# Altium project Mainboard.PrjPcb (part 1 of 3)
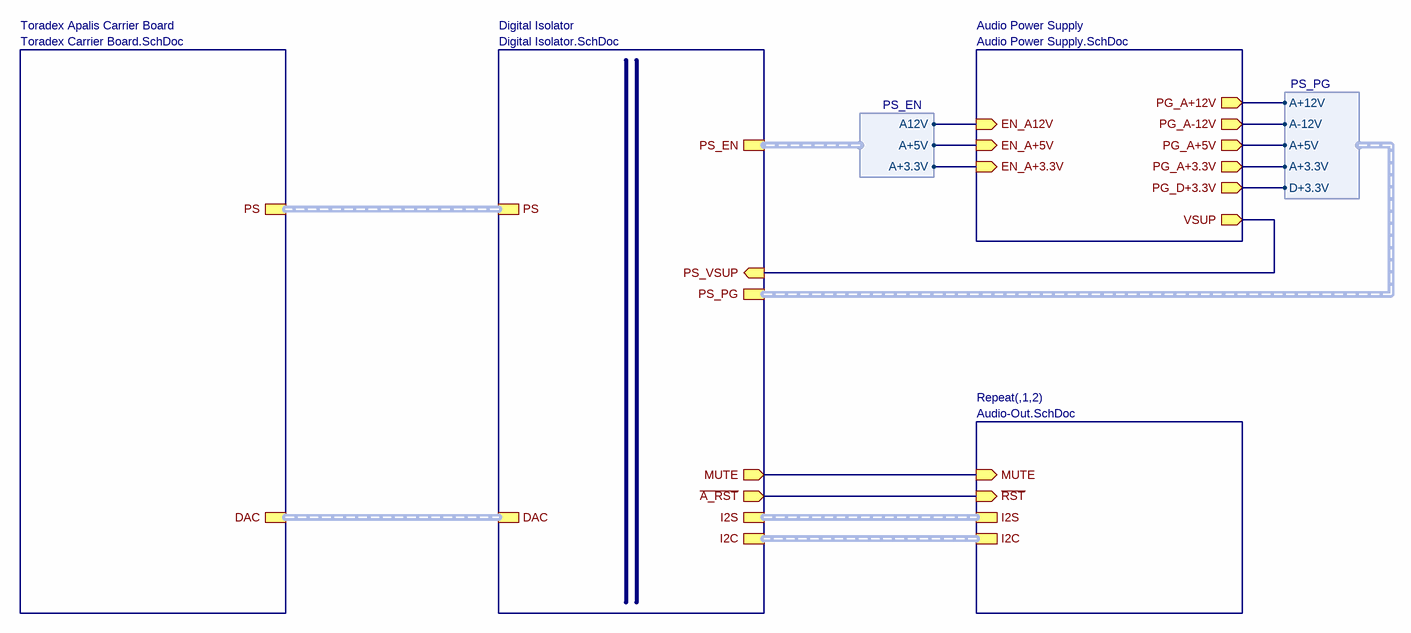
[diagram p0: Hardware Achitecture.SchDoc]
ProjectAuthors: Klossner, Lüthi; ProjectName: Mainboard; Revision: 1.0
19 sheets, 660 parts. Net scope: hierarchical (ports join the sheet entries above them; power ports are global).
Board file: Audio-Streamer-Mainboard.PcbDoc
Sheets:
  Hardware Achitecture.SchDoc
    1 = Audio-Out.SchDoc
    2 = Audio-Out.SchDoc
    Audio Power Supply = Audio Power Supply.SchDoc
    Digital Isolator = Digital Isolator.SchDoc
    Toradex Apalis Carrier Board = Toradex Carrier Board.SchDoc
      Ethernet = Ethernet.SchDoc
      PCI_Express = PCI_Express.SchDoc
      Power_Supply = Power_Supply.SchDoc
      Power_Switch = Power_Switch.SchDoc
      RGB_Display = RGB_Display.SchDoc
      RTC = RTC.SchDoc
      Sata = Sata.SchDoc
      Serial = Serial.SchDoc
      Extension = Extension.SchDoc
      USB_Connectors = USB_Connectors.SchDoc
      USB = USB.SchDoc
      HDMI = HDMI.SchDoc
      Miscellaneous = Miscellaneous.SchDoc
      Audio = Audio.SchDoc

## Sheet Hardware Achitecture.SchDoc
size A3; Date: 27.05.2014; DrawnBy: luths8; Organization: BFH; Address1: Bern University of Applied Sciences; Address2: Engineering and Information Technology; Address3: Jlcoweg 1; Address4: CH-3400 Burgdorf; DocumentNumber: 1; Revision: 1.0; SheetNumber: 1; SheetTotal: 19; CurrentDate: 27.05.2014

### Sub-sheets
Audio Power Supply = Audio Power Supply.SchDoc: PG_A-12V (out), EN_A12V (in), PG_A+3.3V (out), PG_D+3.3V (out), EN_A+3.3V (in), PG_A+12V (out), VSUP (out), EN_A+5V (in), PG_A+5V (out)
Digital Isolator = Digital Isolator.SchDoc: I2C (harness I2C), I2S (harness I2S), DAC (harness DAC), PS (harness PS), ~{A_RST} (out), MUTE (out), PS_VSUP (in), PS_PG (harness PS_PG), PS_EN (harness PS_EN)
Repeat(,1,2) = Audio-Out.SchDoc: ~{RST} (in), I2S (harness I2S), I2C (harness I2C), MUTE (in)
Toradex Apalis Carrier Board = Toradex Carrier Board.SchDoc: PS (harness PS), DAC (harness DAC)

### Harnesses
PS_EN: A12V, A+3.3V, A+5V
PS_PG: A+12V, A-12V, A+3.3V, D+3.3V, A+5V

### Nets
~{A_RST}: sheet Repeat(,1,2)/~{RST}, sheet Digital Isolator/~{A_RST}
MUTE: sheet Repeat(,1,2)/MUTE, sheet Digital Isolator/MUTE
PS_A12V_EN: sheet Audio Power Supply/EN_A12V, sheet Digital Isolator/PS_EN.A12V
PS_A+3.3V_EN: sheet Audio Power Supply/EN_A+3.3V, sheet Digital Isolator/PS_EN.A+3.3V
PS_A+3.3V_PG: sheet Audio Power Supply/PG_A+3.3V, sheet Digital Isolator/PS_PG.A+3.3V
PS_A+5V_EN: sheet Audio Power Supply/EN_A+5V, sheet Digital Isolator/PS_EN.A+5V
PS_A+5V_PG: sheet Audio Power Supply/PG_A+5V, sheet Digital Isolator/PS_PG.A+5V
PS_A+12V_PG: sheet Audio Power Supply/PG_A+12V, sheet Digital Isolator/PS_PG.A+12V
PS_A-12V_PG: sheet Audio Power Supply/PG_A-12V, sheet Digital Isolator/PS_PG.A-12V
PS_D+3.3V_PG: sheet Audio Power Supply/PG_D+3.3V, sheet Digital Isolator/PS_PG.D+3.3V
NetQ400_5: sheet Audio Power Supply/VSUP, sheet Digital Isolator/PS_VSUP

### Buses and harness runs
harness sheet Digital Isolator/DAC = sheet Toradex Apalis Carrier Board/DAC
harness sheet Digital Isolator/I2C = sheet Repeat(,1,2)/I2C
harness sheet Digital Isolator/I2S = sheet Repeat(,1,2)/I2S
harness sheet Digital Isolator/PS = sheet Toradex Apalis Carrier Board/PS

### Notes on the sheet
- Project:
- Size:
- Sheet:
- Title:
- A3
- of
- Drawn by:
- Revision:
- Date:
- Variant:
- b
- File:

## Sheet Audio-Out.SchDoc
size A3; Date: 27.05.2014; DrawnBy: luths8; Organization: BFH; Address1: Bern University of Applied Sciences; Address2: Engineering and Information Technology; Address3: Jlcoweg 1; Address4: CH-3400 Burgdorf; DocumentNumber: 10; Revision: 1.0; SheetNumber: 3; SheetTotal: 19; CurrentDate: 27.05.2014
Used 2 times, as channels 1, 2. Parts and nets are listed once, with the designators drawn on the sheet.
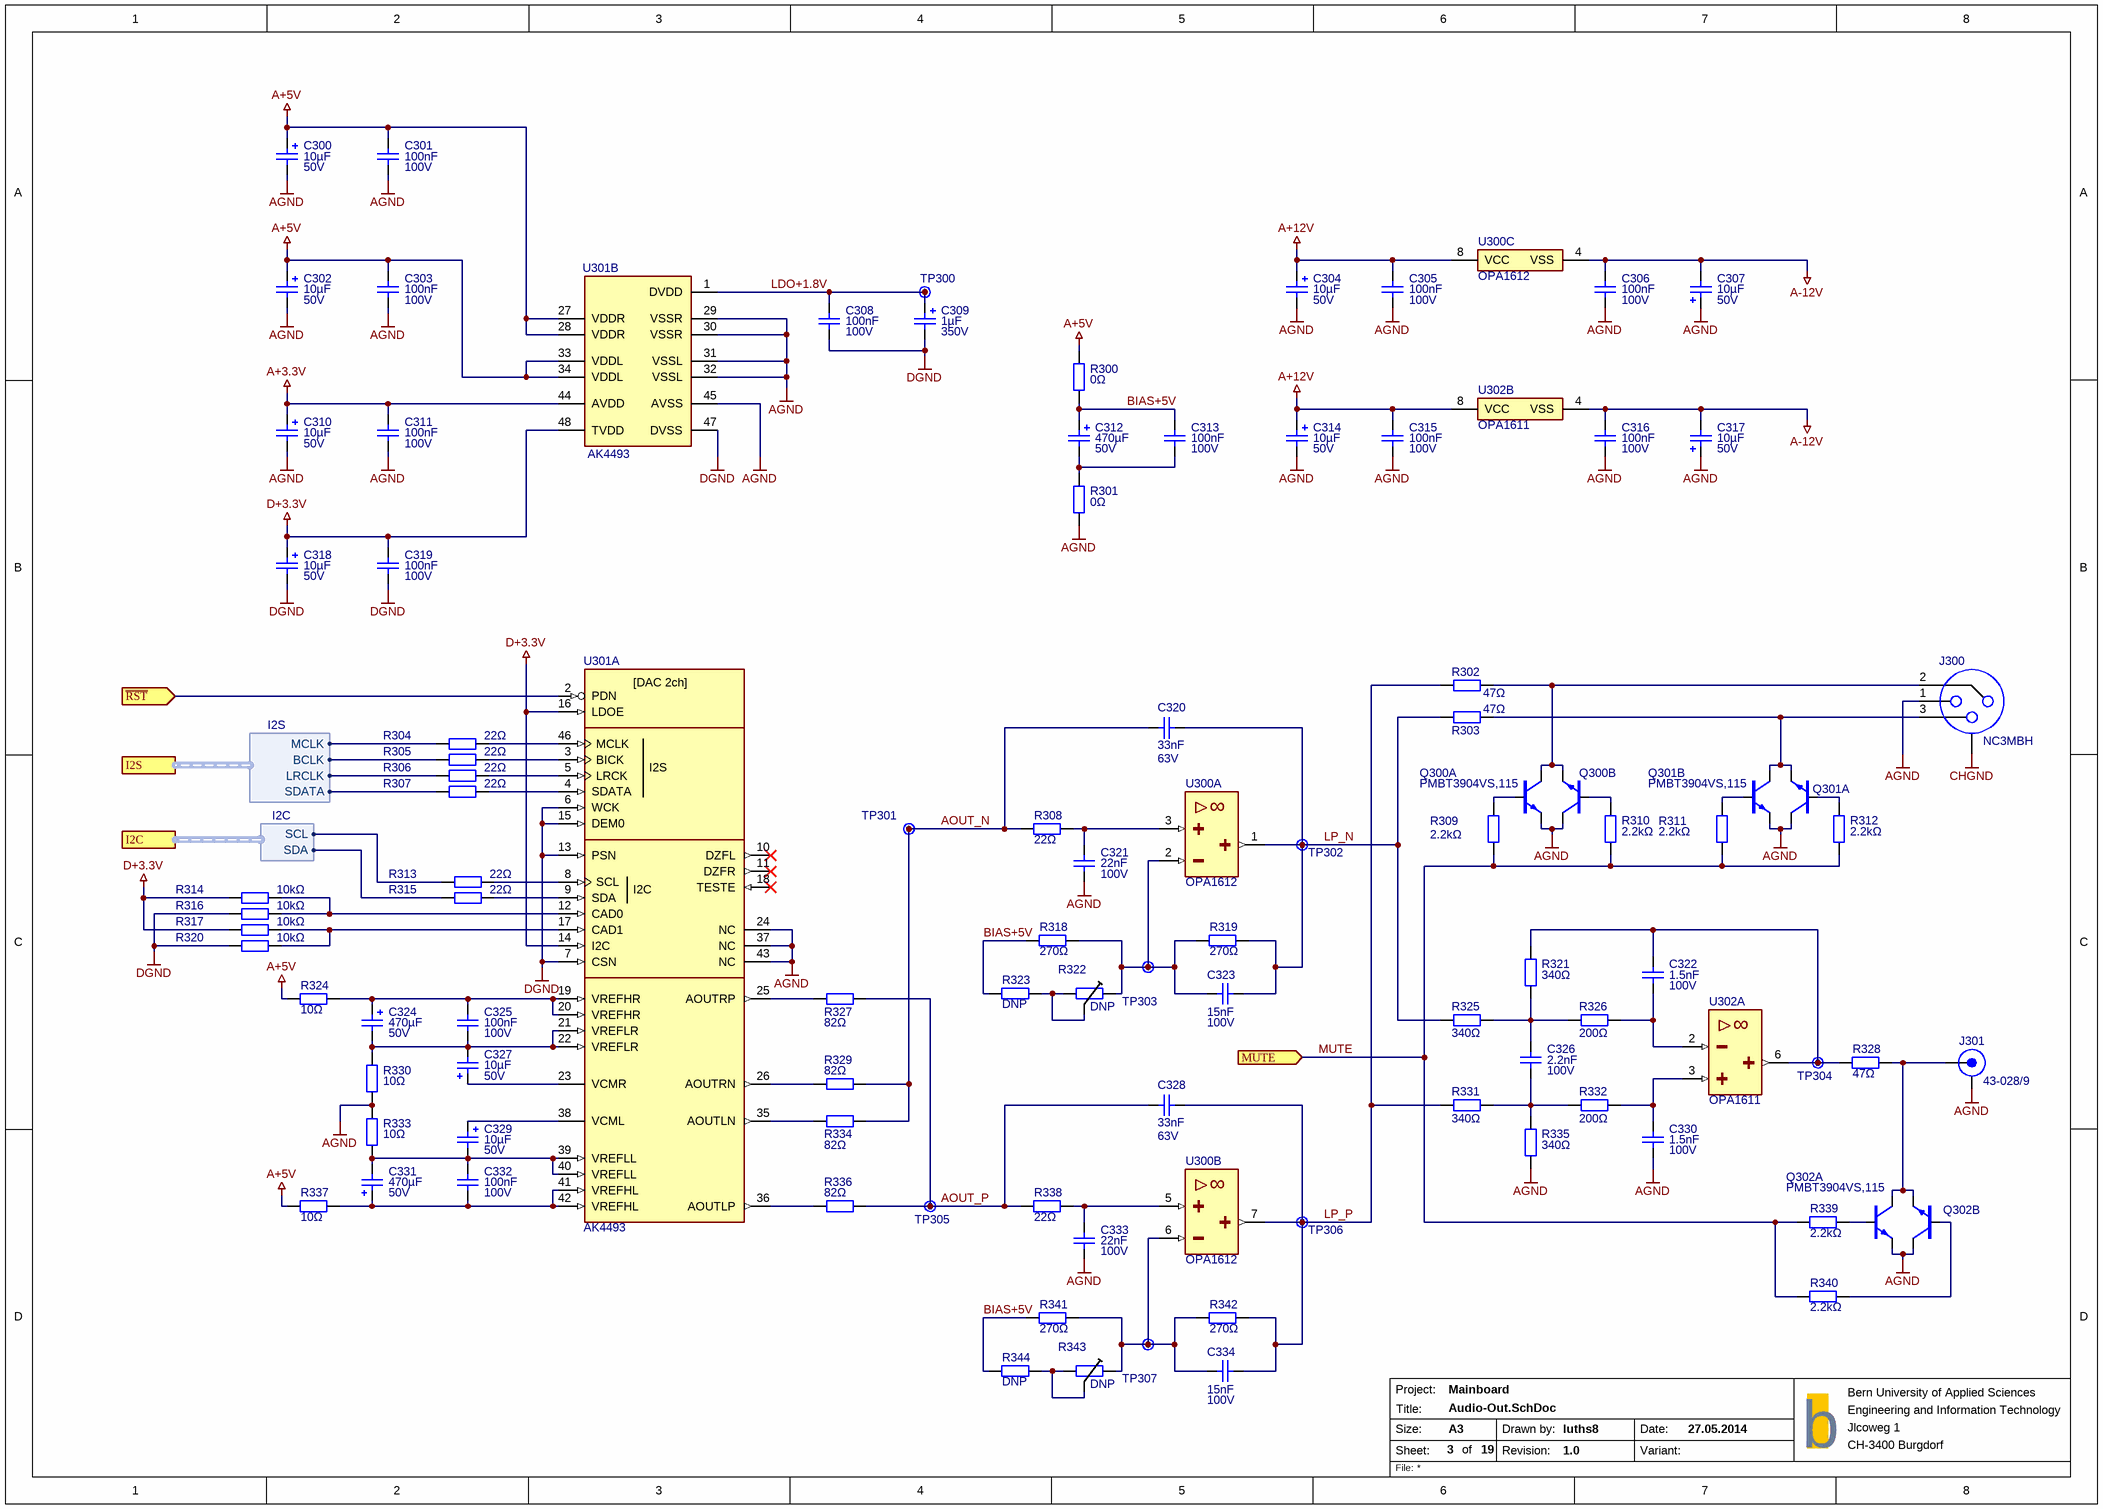
[diagram p1: Audio-Out.SchDoc]

### Parts
C300  10µF  Voltage: 50V  [CAP-5-11.5-2]
C301  100nF  Voltage: 100V  [CAP_WIMA_MKP4F]
C302  10µF  Voltage: 50V  [CAP-5-11.5-2]
C303  100nF  Voltage: 100V  [CAP_WIMA_MKP4F]
C304  10µF  Voltage: 50V  [CAP-5-11.5-2]
C305  100nF  Voltage: 100V  [CAP_WIMA_MKP4F]
C306  100nF  Voltage: 100V  [CAP_WIMA_MKP4F]
C307  10µF  Voltage: 50V  [CAP-5-11.5-2]
C308  100nF  Voltage: 100V  [CAP_WIMA_MKP4F]
C309  1µF  Voltage: 350V  [CAP-6.3-11.2-2.5]
C310  10µF  Voltage: 50V  [CAP-5-11.5-2]
C311  100nF  Voltage: 100V  [CAP_WIMA_MKP4F]
C312  470µF  Voltage: 50V  [CAP-12.5-20-5]
C313  100nF  Voltage: 100V  [CAP_WIMA_MKP4F]
C314  10µF  Voltage: 50V  [CAP-5-11.5-2]
C315  100nF  Voltage: 100V  [CAP_WIMA_MKP4F]
C316  100nF  Voltage: 100V  [CAP_WIMA_MKP4F]
C317  10µF  Voltage: 50V  [CAP-5-11.5-2]
C318  10µF  Voltage: 50V  [CAP-5-11.5-2]
C319  100nF  Voltage: 100V  [CAP_WIMA_MKP4F]
C320  33nF  Voltage: 63V  [CAP_WIMA_FKP2C]
C321  22nF  Voltage: 100V  [CAP_WIMA_FKP2C]
C322  1.5nF  Voltage: 100V  [CAP_WIMA_FKP2D]
C323  15nF  Voltage: 100V  [CAP_WIMA_FKP2C]
C324  470µF  Voltage: 50V  [CAP-12.5-20-5]
C325  100nF  Voltage: 100V  [CAP_WIMA_MKP4F]
C326  2.2nF  Voltage: 100V  [CAP_WIMA_FKP2D]
C327  10µF  Voltage: 50V  [CAP-5-11.5-2]
C328  33nF  Voltage: 63V  [CAP_WIMA_FKP2C]
C329  10µF  Voltage: 50V  [CAP-5-11.5-2]
C330  1.5nF  Voltage: 100V  [CAP_WIMA_FKP2D]
C331  470µF  Voltage: 50V  [CAP-12.5-20-5]
C332  100nF  Voltage: 100V  [CAP_WIMA_MKP4F]
C333  22nF  Voltage: 100V  [CAP_WIMA_FKP2C]
C334  15nF  Voltage: 100V  [CAP_WIMA_FKP2C]
J300  NC3MBH  [NC3MBH]
J301  43-028/9  [RCA-Plug]
Q300  PMBT3904VS,115  [SOT-666]  (parts A,B of 2)
Q301  PMBT3904VS,115  [SOT-666]  (value not drawn)  (parts A,B of 2)
Q302  PMBT3904VS,115  [SOT-666]  (parts A,B of 2)
R300  0Ω  [SMD0603RES]
R301  0Ω  [SMD0603RES]
R302  47Ω  [SMD0603RES]
R303  47Ω  [SMD0603RES]
R304  22Ω  [SMD0603RES]
R305  22Ω  [SMD0603RES]
R306  22Ω  [SMD0603RES]
R307  22Ω  [SMD0603RES]
R308  22Ω  [SMD0603RES]
R309  2.2kΩ  [SMD0603RES]
R310  2.2kΩ  [SMD0603RES]
R311  2.2kΩ  [SMD0603RES]
R312  2.2kΩ  [SMD0603RES]
R313  22Ω  [SMD0603RES]
R314  10kΩ  [SMD0603RES]
R315  22Ω  [SMD0603RES]
R316  10kΩ  [SMD0603RES]
R317  10kΩ  [SMD0603RES]
R318  270Ω  [SMD0603RES]
R319  270Ω  [SMD0603RES]
R320  10kΩ  [SMD0603RES]
R321  340Ω  [SMD0603RES]
R322  DNP  [3266]
R323  DNP  [SMD0603RES]
R324  10Ω  [SMD0603RES]
R325  340Ω  [SMD0603RES]
R326  200Ω  [SMD0603RES]
R327  82Ω  [SMD0603RES]
R328  47Ω  [SMD0603RES]
R329  82Ω  [SMD0603RES]
R330  10Ω  [SMD0603RES]
R331  340Ω  [SMD0603RES]
R332  200Ω  [SMD0603RES]
R333  10Ω  [SMD0603RES]
R334  82Ω  [SMD0603RES]
R335  340Ω  [SMD0603RES]
R336  82Ω  [SMD0603RES]
R337  10Ω  [SMD0603RES]
R338  22Ω  [SMD0603RES]
R339  2.2kΩ  [SMD0603RES]
R340  2.2kΩ  [SMD0603RES]
R341  270Ω  [SMD0603RES]
R342  270Ω  [SMD0603RES]
R343  DNP  [3266]
R344  DNP  [SMD0603RES]
TP300  Testpoint  [TP]  (value not drawn)  (no BOM)
TP301  Testpoint  [TP]  (value not drawn)  (no BOM)
TP302  Testpoint  [TP]  (value not drawn)  (no BOM)
TP303  Testpoint  [TP]  (value not drawn)  (no BOM)
TP304  Testpoint  [TP]  (value not drawn)  (no BOM)
TP305  Testpoint  [TP]  (value not drawn)  (no BOM)
TP306  Testpoint  [TP]  (value not drawn)  (no BOM)
TP307  Testpoint  [TP]  (value not drawn)  (no BOM)
U300  OPA1612  [SOIC8]  (parts A,B,C of 3)
U301  AK4493  [LQFP48]  (parts A,B of 2)
U302  OPA1611  [SOIC8]  (parts A,B of 2)

### Ports
I2C (harness I2C), I2S (harness I2S), MUTE (in), ~{RST} (in)

### Harnesses
I2S: MCLK, BCLK, LRCLK, SDATA
I2C: SCL, SDA

### Nets
A+3.3V: C310.P C311.2(q) U301.44(AVDD)
A+5V: C300.P C301.2(q) C302.P C303.2(q) R300.1 R324.2 R337.1 U301.27(VDDR) U301.28(VDDR) U301.33(VDDL) U301.34(VDDL)
A+12V: C304.P C305.2(q) C314.P C315.2(q) U300.8(VCC) U302.8(VCC)
A-12V: C306.1 C307.M(q) C316.1 C317.M(q) U300.4(VSS) U302.4(VSS)
AGND: C300.M(q) C301.1 C302.M(q) C303.1 C304.M(q) C305.1 C306.2(q) C307.P C310.M(q) C311.1 C314.M(q) C315.1 C316.2(q) C317.P C321.1 C330.1 C333.1 J300.1 J301.2 Q300.1 Q300.3 Q301.4 Q301.6 Q302.1 Q302.3 R301.2 R330.2 R333.1 R335.1 U301.24(NC) U301.29(VSSR) U301.30(VSSR) U301.31(VSSL) U301.32(VSSL) U301.37(NC) U301.43(NC) U301.45(AVSS)
CHGND: J300.0
D+3.3V: C318.P C319.2(q) R314.2 R317.2 U301.14(I2C) U301.16(LDOE) U301.48(TVDD)
DGND: C308.1 C309.M(q) C318.M(q) C319.1 R316.2 R320.2 U301.6(WCK) U301.7(CSN) U301.13(PSN) U301.15(DEM0) U301.47(DVSS)
AOUT_N: C320.1 R308.2 R329.1 R334.1 TP301.1
AOUT_P: C328.1 R327.1 R336.1 R338.2 TP305.1
BIAS+5V: C312.P C313.2(q) R300.2 R318.2 R323.2 R341.2 R344.2
LDO+1.8V: C308.2(q) C309.P TP300.1 U301.1(DVDD)
LP_N: C320.2(q) C323.1 R303.2 R319.1 R325.2 TP302.1 U300.1(OUTA)
LP_P: C328.2(q) C334.1 R302.2 R331.2 R342.1 TP306.1 U300.7(OUTB)
MUTE: R309.1 R310.1 R311.1 R312.1 R339.2 R340.2 ; port MUTE
~{RST}: U301.2(PDN) ; port ~{RST}
NetC312_M: C312.M(q) C313.1 R301.1
NetC321_2: C321.2(q) R308.1 U300.3(PINA)
NetC322_1: C322.1 R321.1 R328.2 TP304.1 U302.6(OUT)
NetC322_2: C322.2(q) R326.2 U302.2(NIN)
NetC323_2: C323.2(q) R318.1 R319.2 R322.1 TP303.1 U300.2(NINA)
NetC324_M: C324.M(q) C325.1 C327.M(q) R330.1 U301.21(VREFLR) U301.22(VREFLR)
NetC324_P: C324.P C325.2(q) R324.1 U301.19(VREFHR) U301.20(VREFHR)
NetC326_1: C326.1 R321.2 R325.1 R326.1
NetC326_2: C326.2(q) R331.1 R332.1 R335.2
NetC327_P: C327.P U301.23(VCMR)
NetC329_M: C329.M(q) C331.M(q) C332.2(q) R333.2 U301.39(VREFLL) U301.40(VREFLL)
NetC329_P: C329.P U301.38(VCML)
NetC330_2: C330.2(q) R332.2 U302.3(PIN)
NetC331_P: C331.P C332.1 R337.2 U301.41(VREFHL) U301.42(VREFHL)
NetC333_2: C333.2(q) R338.1 U300.5(PINB)
NetC334_2: C334.2(q) R341.1 R342.2 R343.1 TP307.1 U300.6(NINB)
NetJ300_2: J300.2 Q300.4 Q300.6 R302.1
NetJ300_3: J300.3 Q301.1 Q301.3 R303.1
NetJ301_1: J301.1 Q302.4 Q302.6 R328.1
NetQ300_2: Q300.2 R309.2
NetQ300_5: Q300.5 R310.2
NetQ301_2: Q301.2 R312.2
NetQ301_5: Q301.5 R311.2
NetQ302_2: Q302.2 R339.1
NetQ302_5: Q302.5 R340.1
NetR304_1: R304.1 U301.46(MCLK)
NetR304_2: R304.2 ; port I2S.MCLK
NetR305_1: R305.1 U301.3(BICK)
NetR305_2: R305.2 ; port I2S.BCLK
NetR306_1: R306.1 U301.5(LRCK)
NetR306_2: R306.2 ; port I2S.LRCLK
NetR307_1: R307.1 U301.4(SDATA)
NetR307_2: R307.2 ; port I2S.SDATA
NetR313_1: R313.1 U301.8(SCL)
NetR313_2: R313.2 ; port I2C.SCL
NetR314_1: R314.1 R316.1 U301.12(CAD0)
NetR315_1: R315.1 U301.9(SDA)
NetR315_2: R315.2 ; port I2C.SDA
NetR317_1: R317.1 R320.1 U301.17(CAD1)
NetR322_2: R322.2 R322.3 R323.1
NetR327_2: R327.2 U301.25(AOUTRP)
NetR329_2: R329.2 U301.26(AOUTRN)
NetR334_2: R334.2 U301.35(AOUTLN)
NetR336_2: R336.2 U301.36(AOUTLP)
NetR343_2: R343.2 R343.3 R344.1

Not connected (* = marked no-connect by the designer): U301 10(DZFL)* 11(DZFR)* 18(TESTE)*

### Channels
1: designators end in _1; ports MUTE=MUTE ~{RST}=~{A_RST}
2: designators end in _2; ports MUTE=MUTE ~{RST}=~{A_RST}

### Notes on the sheet
- Project:
- Size:
- Sheet:
- Title:
- A3
- of
- Drawn by:
- Revision:
- Date:
- Variant:
- b
- File:
- (in symbol AK4493, part A) [DAC 2ch]; I2S
- (in symbol OPA1611, part A) ∞
- (in symbol OPA1612, part A) ∞
- (in symbol OPA1612, part B) ∞

### Library data of the parts
C300 C302 C304 C307 C310 C314 C317 C318 C327 C329 = Capacitor Electrolytic: Elektrolytic Capacitor; Manufacturer Part No.: EEU-FR1H100
C301 C303 C305 C306 C308 C311 C313 C315 C316 C319 C325 C332 = Capacitor Ceramic: Ceramic Capacitor; Manufacturer Part No.: MKP2D031001F00KF00
C309 = Capacitor Electrolytic: Elektrolytic Capacitor; Supplier 1: Mouser; Supplier Part Number 1: 667-ECA-2VM010; Manufacturer Part No.: *
C312 C324 C331 = Capacitor Electrolytic: Elektrolytic Capacitor; Manufacturer Part No.: EEU-FR1H471
C320 C328 = Capacitor Ceramic: Ceramic Capacitor; Manufacturer Part No.: FKP2C023301L00HSSD
C321 C333 = Capacitor Ceramic: Ceramic Capacitor; Manufacturer Part No.: FKP2D022201L00HF00
C322 C330 = Capacitor Ceramic: Ceramic Capacitor; Manufacturer Part No.: FKP2D011501D00HSSD
C323 C334 = Capacitor Ceramic: Ceramic Capacitor; Manufacturer Part No.: FKP2D021501J00HSSD
C326 = Capacitor Ceramic: Ceramic Capacitor; Manufacturer Part No.: FKP2D012201D00HSSD
J300 = Connector XLR: XLR Connector Male, Panel Mount; Manufacturer Part No.: NC3MBH; System: Connector
J301 = Connector RCA: RCA Connector; Manufacturer Part No.: *; System: Connector
Q300-Q302 = Transistor Bipolar Dual: Manufacturer Part No.: PMBT3904VS,115
R300 R301 R304-R307 R309-R317 R320 R324 R330 R333 R337 R339 R340 = Resistor: Manufacturer Part No.: *
R302 R303 R328 = Resistor: Resistor Thin Film; Manufacturer Part No.: TNPW060347R0BEEA
R308 R327 R329 R334 R336 R338 = Resistor: Resistor Thin Film; Manufacturer Part No.: TNPW060322R0BEEA
R318 R319 R341 R342 = Resistor: Resistor Thin Film; Manufacturer Part No.: TNPW0603270RBEEA
R321 R325 R331 R335 = Resistor: Resistor Thin Film; Manufacturer Part No.: TNPW0603340RBEEA
R322 R343 = Resistor Trimmer: Trimmer (resistive)
R323 R344 = Resistor: Resistor Thin Film; Manufacturer Part No.: *
R326 R332 = Resistor: Resistor Thin Film; Manufacturer Part No.: TNPW0603200RBEEA
U300 = OPA1612: SoundPlus Operational Amplifier; Manufacturer Part No.: OPA1612AIDR
U301 = AK4493: 32-Bit 2ch Audio DAC; Manufacturer Part No.: AK4493EQ
U302 = OPA1611: SoundPlus Operational Amplifier; Manufacturer Part No.: OPA1611AIDR
TP300-TP307 = Testpoint: Manufacturer Part No.: *

## Sheet Audio Power Supply.SchDoc
size A3; Date: 27.05.2014; DrawnBy: luths8; Organization: BFH; Address1: Bern University of Applied Sciences; Address2: Engineering and Information Technology; Address3: Jlcoweg 1; Address4: CH-3400 Burgdorf; DocumentNumber: 2; Revision: 1.0; SheetNumber: 2; SheetTotal: 19; CurrentDate: 27.05.2014
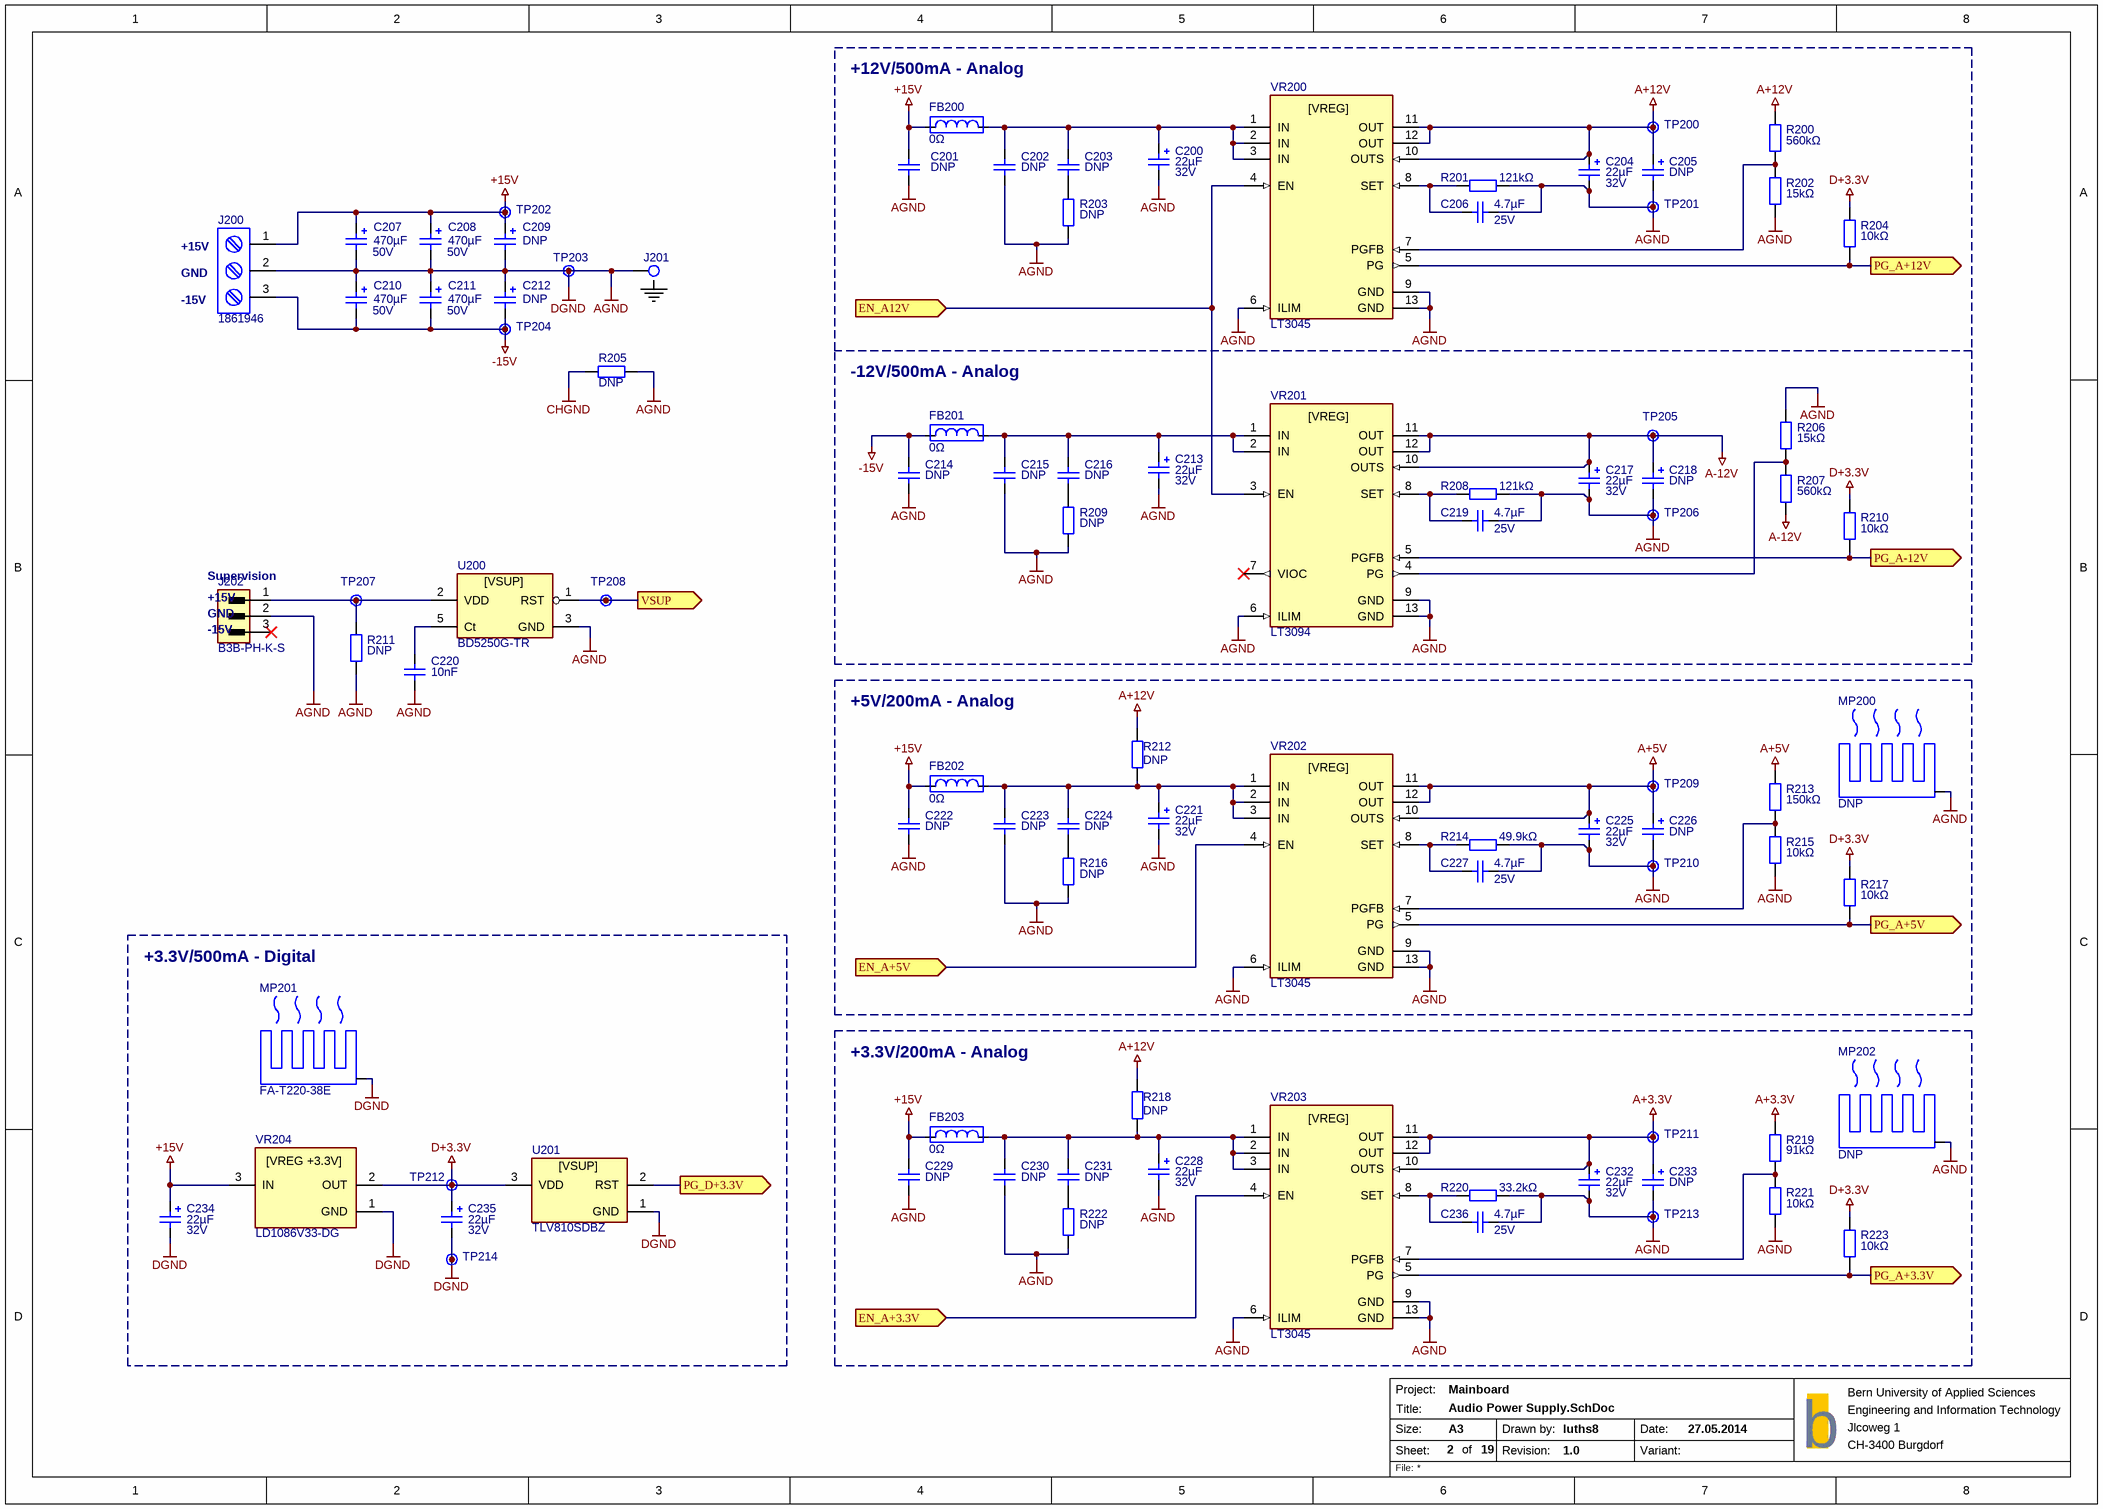
[diagram p2: Audio Power Supply.SchDoc]

### Parts
C200  22µF  Voltage: 32V  [CAP-6.3-5.5-2.5]
C201  DNP  [SMD0805CAP]
C202  DNP  [SMD0805CAP]
C203  DNP  [SMD0805CAP]
C204  22µF  Voltage: 32V  [CAP-6.3-5.5-2.5]
C205  DNP  [CAP-6.3-5.5-2.5]
C206  4.7µF  Voltage: 25V  [SMD1206CAP]
C207  470µF  Voltage: 50V  [CAP-12.5-20-5]
C208  470µF  Voltage: 50V  [CAP-12.5-20-5]
C209  DNP  [CAP-12.5-20-5]
C210  470µF  Voltage: 50V  [CAP-12.5-20-5]
C211  470µF  Voltage: 50V  [CAP-12.5-20-5]
C212  DNP  [CAP-12.5-20-5]
C213  22µF  Voltage: 32V  [CAP-6.3-5.5-2.5]
C214  DNP  [SMD0805CAP]
C215  DNP  [SMD0805CAP]
C216  DNP  [SMD0805CAP]
C217  22µF  Voltage: 32V  [CAP-6.3-5.5-2.5]
C218  DNP  [CAP-6.3-5.5-2.5]
C219  4.7µF  Voltage: 25V  [SMD1206CAP]
C220  10nF  [SMD0603CAP]
C221  22µF  Voltage: 32V  [CAP-6.3-5.5-2.5]
C222  DNP  [SMD0805CAP]
C223  DNP  [SMD0805CAP]
C224  DNP  [SMD0805CAP]
C225  22µF  Voltage: 32V  [CAP-6.3-5.5-2.5]
C226  DNP  [CAP-6.3-5.5-2.5]
C227  4.7µF  Voltage: 25V  [SMD1206CAP]
C228  22µF  Voltage: 32V  [CAP-6.3-5.5-2.5]
C229  DNP  [SMD0805CAP]
C230  DNP  [SMD0805CAP]
C231  DNP  [SMD0805CAP]
C232  22µF  Voltage: 32V  [CAP-6.3-5.5-2.5]
C233  DNP  [CAP-6.3-5.5-2.5]
C234  22µF  Voltage: 32V  [CAP-6.3-5.5-2.5]
C235  22µF  Voltage: 32V  [CAP-6.3-5.5-2.5]
C236  4.7µF  Voltage: 25V  [SMD1206CAP]
FB200  0Ω  [SMD0603RES]
FB201  0Ω  [SMD0603RES]
FB202  0Ω  [SMD0603RES]
FB203  0Ω  [SMD0603RES]
J200  1861946  [1861946]
J201  Solder Pin  [SOLDER_PIN]  (value not drawn)  (net tie, no BOM)
J202  B3B-PH-K-S  [B3B-PH-K-S]
MP200  DNP  [DA-T263-201E]
MP201  FA-T220-38E  [FA-T220-38E]
MP202  DNP  [DA-T263-201E]
R200  560kΩ  [SMD0603RES]
R201  121kΩ  [SMD0603RES]
R202  15kΩ  [SMD0603RES]
R203  DNP  [SMD0603RES]
R204  10kΩ  [SMD0603RES]
R205  DNP  [SMD0805RES]
R206  15kΩ  [SMD0603RES]
R207  560kΩ  [SMD0603RES]
R208  121kΩ  [SMD0603RES]
R209  DNP  [SMD0603RES]
R210  10kΩ  [SMD0603RES]
R211  DNP  [SMD0603RES]
R212  DNP  [SMD0603RES]
R213  150kΩ  [SMD0603RES]
R214  49.9kΩ  [SMD0603RES]
R215  10kΩ  [SMD0603RES]
R216  DNP  [SMD0603RES]
R217  10kΩ  [SMD0603RES]
R218  DNP  [SMD0603RES]
R219  91kΩ  [SMD0603RES]
R220  33.2kΩ  [SMD0603RES]
R221  10kΩ  [SMD0603RES]
R222  DNP  [SMD0603RES]
R223  10kΩ  [SMD0603RES]
TP200  Testpoint  [TP]  (value not drawn)  (no BOM)
TP201  Testpoint  [TP]  (value not drawn)  (no BOM)
TP202  Testpoint  [TP]  (value not drawn)  (no BOM)
TP203  Testpoint  [TP]  (value not drawn)  (no BOM)
TP204  Testpoint  [TP]  (value not drawn)  (no BOM)
TP205  Testpoint  [TP]  (value not drawn)  (no BOM)
TP206  Testpoint  [TP]  (value not drawn)  (no BOM)
TP207  Testpoint  [TP]  (value not drawn)  (no BOM)
TP208  Testpoint  [TP]  (value not drawn)  (no BOM)
TP209  Testpoint  [TP]  (value not drawn)  (no BOM)
TP210  Testpoint  [TP]  (value not drawn)  (no BOM)
TP211  Testpoint  [TP]  (value not drawn)  (no BOM)
TP212  Testpoint  [TP]  (value not drawn)  (no BOM)
TP213  Testpoint  [TP]  (value not drawn)  (no BOM)
TP214  Testpoint  [TP]  (value not drawn)  (no BOM)
U200  BD5250G-TR  [SOT-23-5]
U201  TLV810SDBZ  [SOT-23]
VR200  LT3045  [MSOP12]
VR201  LT3094  [MSOP12]
VR202  LT3045  [MSOP12]
VR203  LT3045  [MSOP12]
VR204  LD1086V33-DG  [TO220-3]

### Blocks framed on the sheet
+12V/500mA - Analog: C200-C206 FB200 R200-R204 TP200 TP201 VR200
+5V/200mA - Analog: C221-C227 FB202 MP200 R212-R217 TP209 TP210 VR202
+3.3V/500mA - Digital: C234 C235 MP201 TP212 TP214 U201 VR204
+3.3V/200mA - Analog: C228-C233 C236 FB203 MP202 R218-R223 TP211 TP213 VR203

### Ports
EN_A12V (in), EN_A+3.3V (in), EN_A+5V (in), PG_A+3.3V (out), PG_A+5V (out), PG_A+12V (out), PG_A-12V (out), PG_D+3.3V (out), VSUP (out)

### Nets
+15V: C201.2(q) C207.P C208.P C209.P C222.2(q) C229.2(q) C234.P FB200.1 FB202.1 FB203.1 J200.1 TP202.1 VR204.3(IN)
-15V: C210.M(q) C211.M(q) C212.M(q) C214.2(q) FB201.1 J200.3 TP204.1
A+3.3V: C232.P C233.P R219.2 TP211.1 VR203.10(OUTS) VR203.11(OUT) VR203.12(OUT)
A+5V: C225.P C226.P R213.2 TP209.1 VR202.10(OUTS) VR202.11(OUT) VR202.12(OUT)
A+12V: C204.P C205.P R200.2 R212.1 R218.1 TP200.1 VR200.10(OUTS) VR200.11(OUT) VR200.12(OUT)
A-12V: C217.P C218.P R207.2 TP205.1 VR201.10(OUTS) VR201.11(OUT) VR201.12(OUT)
AGND: C200.M(q) C201.1 C202.1 C204.M(q) C205.M(q) C206.2(q) C207.M(q) C208.M(q) C209.M(q) C210.P C211.P C212.P C213.M(q) C214.1 C215.1 C217.M(q) C218.M(q) C219.2(q) C220.1 C221.M(q) C222.1 C223.1 C225.M(q) C226.M(q) C227.2(q) C228.M(q) C229.1 C230.1 C232.M(q) C233.M(q) C234.M(q) C235.M(q) C236.2(q) J200.2 J201.1 J202.2 MP200.0 MP201.0 MP202.0 R201.2 R202.1 R203.1 R205.1 R206.1 R208.2 R209.1 R211.1 R214.2 R215.1 R216.1 R220.2 R221.1 R222.1 TP201.1 TP203.1 TP206.1 TP210.1 TP213.1 TP214.1 U200.3(GND) U201.1(GND) VR200.6(ILIM) VR200.9(GND) VR200.13(GND) VR201.6(ILIM) VR201.9(GND) VR201.13(GND) VR202.6(ILIM) VR202.9(GND) VR202.13(GND) VR203.6(ILIM) VR203.9(GND) VR203.13(GND) VR204.1(GND)  [also labelled DGND]
CHGND: R205.2
D+3.3V: C235.P R204.2 R210.2 R217.2 R223.2 TP212.1 U201.3(VDD) VR204.2(OUT)
PS_A12V_EN: VR200.4(EN) VR201.3(EN) ; port EN_A12V
PS_A+3.3V_EN: VR203.4(EN) ; port EN_A+3.3V
PS_A+3.3V_PG: R223.1 VR203.5(PG) ; port PG_A+3.3V
PS_A+5V_EN: VR202.4(EN) ; port EN_A+5V
PS_A+5V_PG: R217.1 VR202.5(PG) ; port PG_A+5V
PS_A+12V_PG: R204.1 VR200.5(PG) ; port PG_A+12V
PS_A-12V_PG: R210.1 VR201.5(PGFB) ; port PG_A-12V
PS_D+3.3V_PG: U201.2(RST) ; port PG_D+3.3V
NetC200_P: C200.P C202.2(q) C203.2(q) FB200.2 VR200.1(IN) VR200.2(IN) VR200.3(IN)
NetC203_1: C203.1 R203.2
NetC206_1: C206.1 R201.1 VR200.8(SET)
NetC213_P: C213.P C215.2(q) C216.2(q) FB201.2 VR201.1(IN) VR201.2(IN)
NetC216_1: C216.1 R209.2
NetC219_1: C219.1 R208.1 VR201.8(SET)
NetC220_2: C220.2(q) U200.5(Ct)
NetC221_P: C221.P C223.2(q) C224.2(q) FB202.2 R212.2 VR202.1(IN) VR202.2(IN) VR202.3(IN)
NetC224_1: C224.1 R216.2
NetC227_1: C227.1 R214.1 VR202.8(SET)
NetC228_P: C228.P C230.2(q) C231.2(q) FB203.2 R218.2 VR203.1(IN) VR203.2(IN) VR203.3(IN)
NetC231_1: C231.1 R222.2
NetC236_1: C236.1 R220.1 VR203.8(SET)
NetJ202_1: J202.1 R211.2 TP207.1 U200.2(VDD)
NetQ400_5: TP208.1 U200.1(RST) ; port VSUP
NetR200_1: R200.1 R202.2 VR200.7(PGFB)
NetR206_2: R206.2 R207.1 VR201.4(PG)
NetR213_1: R213.1 R215.2 VR202.7(PGFB)
NetR219_1: R219.1 R221.2 VR203.7(PGFB)

Not connected (* = marked no-connect by the designer): J202 3*; VR201 7(VIOC)*

### Notes on the sheet
- (near J200) +15V
- (near J200) GND
- (near J200) -15V
- (near FB201) -12V/500mA - Analog
- (near J202) Supervision
- (near J202) +15V
- (near J202) GND
- (near J202) -15V
- Project:
- Size:
- Sheet:
- Title:
- A3
- of
- Drawn by:
- Revision:
- Date:
- Variant:
- b
- File:
- (in symbol LD1086V33-DG) [VREG +3.3V]
- (in symbol LT3045) [VREG]
- (in symbol LT3094) [VREG]
- (in symbol Voltage Supervisor) [VSUP]
- (in symbol Voltage Supervisor 5V) [VSUP]

### Library data of the parts
C200 C204 C213 C217 C221 C225 C228 C232 C234 C235 = Capacitor Electrolytic: Elektrolytic Capacitor; Manufacturer Part No.: 32SEPF22M
C201-C203 C214-C216 C220 C222-C224 C229-C231 = Capacitor Ceramic: Ceramic Capacitor; Voltage: 25V; Manufacturer Part No.: *
C205 C218 C226 C233 = Capacitor Electrolytic: Elektrolytic Capacitor; Manufacturer Part No.: 32SEPF22M; Voltage: 32V
C206 C219 C227 C236 = Capacitor Ceramic: Ceramic Capacitor; Manufacturer Part No.: *
C207 C208 C210 C211 = Capacitor Electrolytic: as C312 on sheet Audio-Out
C209 C212 = Capacitor Electrolytic: Elektrolytic Capacitor; Manufacturer Part No.: EEU-FR1H471; Voltage: 50V
FB200-FB203 = Ferrite Bead: Manufacturer Part No.: *
J200 = 1861946: Screw Terminal, 3 Position; System: Connector; Manufacturer Part No.: 1861946
J202 = Connector 3x1P: Manufacturer Part No.: B3B-PH-K-S; System: Connector
MP200-MP202 = Heatsink
  MP200 MP202: Manufacturer Part No.: DA-T263-201E
  MP201: Manufacturer Part No.: FA-T220-38E
R200-R223 = Resistor: Manufacturer Part No.: *
U200 = Voltage Supervisor 5V: Voltage Supervisor, Threshold 5V; Manufacturer Part No.: BD5250G-TR
U201 = Voltage Supervisor: Voltage Supervisor, Threshold 2.94V; Manufacturer Part No.: TLV810SDBZR
VR200 VR202 VR203 = LT3045: Linear Regulator, positive Rail, Low Noise, High PSRR; Manufacturer Part No.: LT3045EMSE#PBF
VR201 = LT3094: Linear Regulator, negative Rail Low Noise, High PSRR; Manufacturer Part No.: LT3094EMSE#PBF
VR204 = LD1086V33-DG: Linear Voltage Regulator, positive Rail; Manufacturer Part No.: LD1086V33-DG
TP200-TP214 = Testpoint: Manufacturer Part No.: *

## Sheet Digital Isolator.SchDoc
size A3; Date: 27.05.2014; DrawnBy: luths8; Organization: BFH; Address1: Bern University of Applied Sciences; Address2: Engineering and Information Technology; Address3: Jlcoweg 1; Address4: CH-3400 Burgdorf; DocumentNumber: 17; Revision: 1.0; SheetNumber: 4; SheetTotal: 19; CurrentDate: 27.05.2014
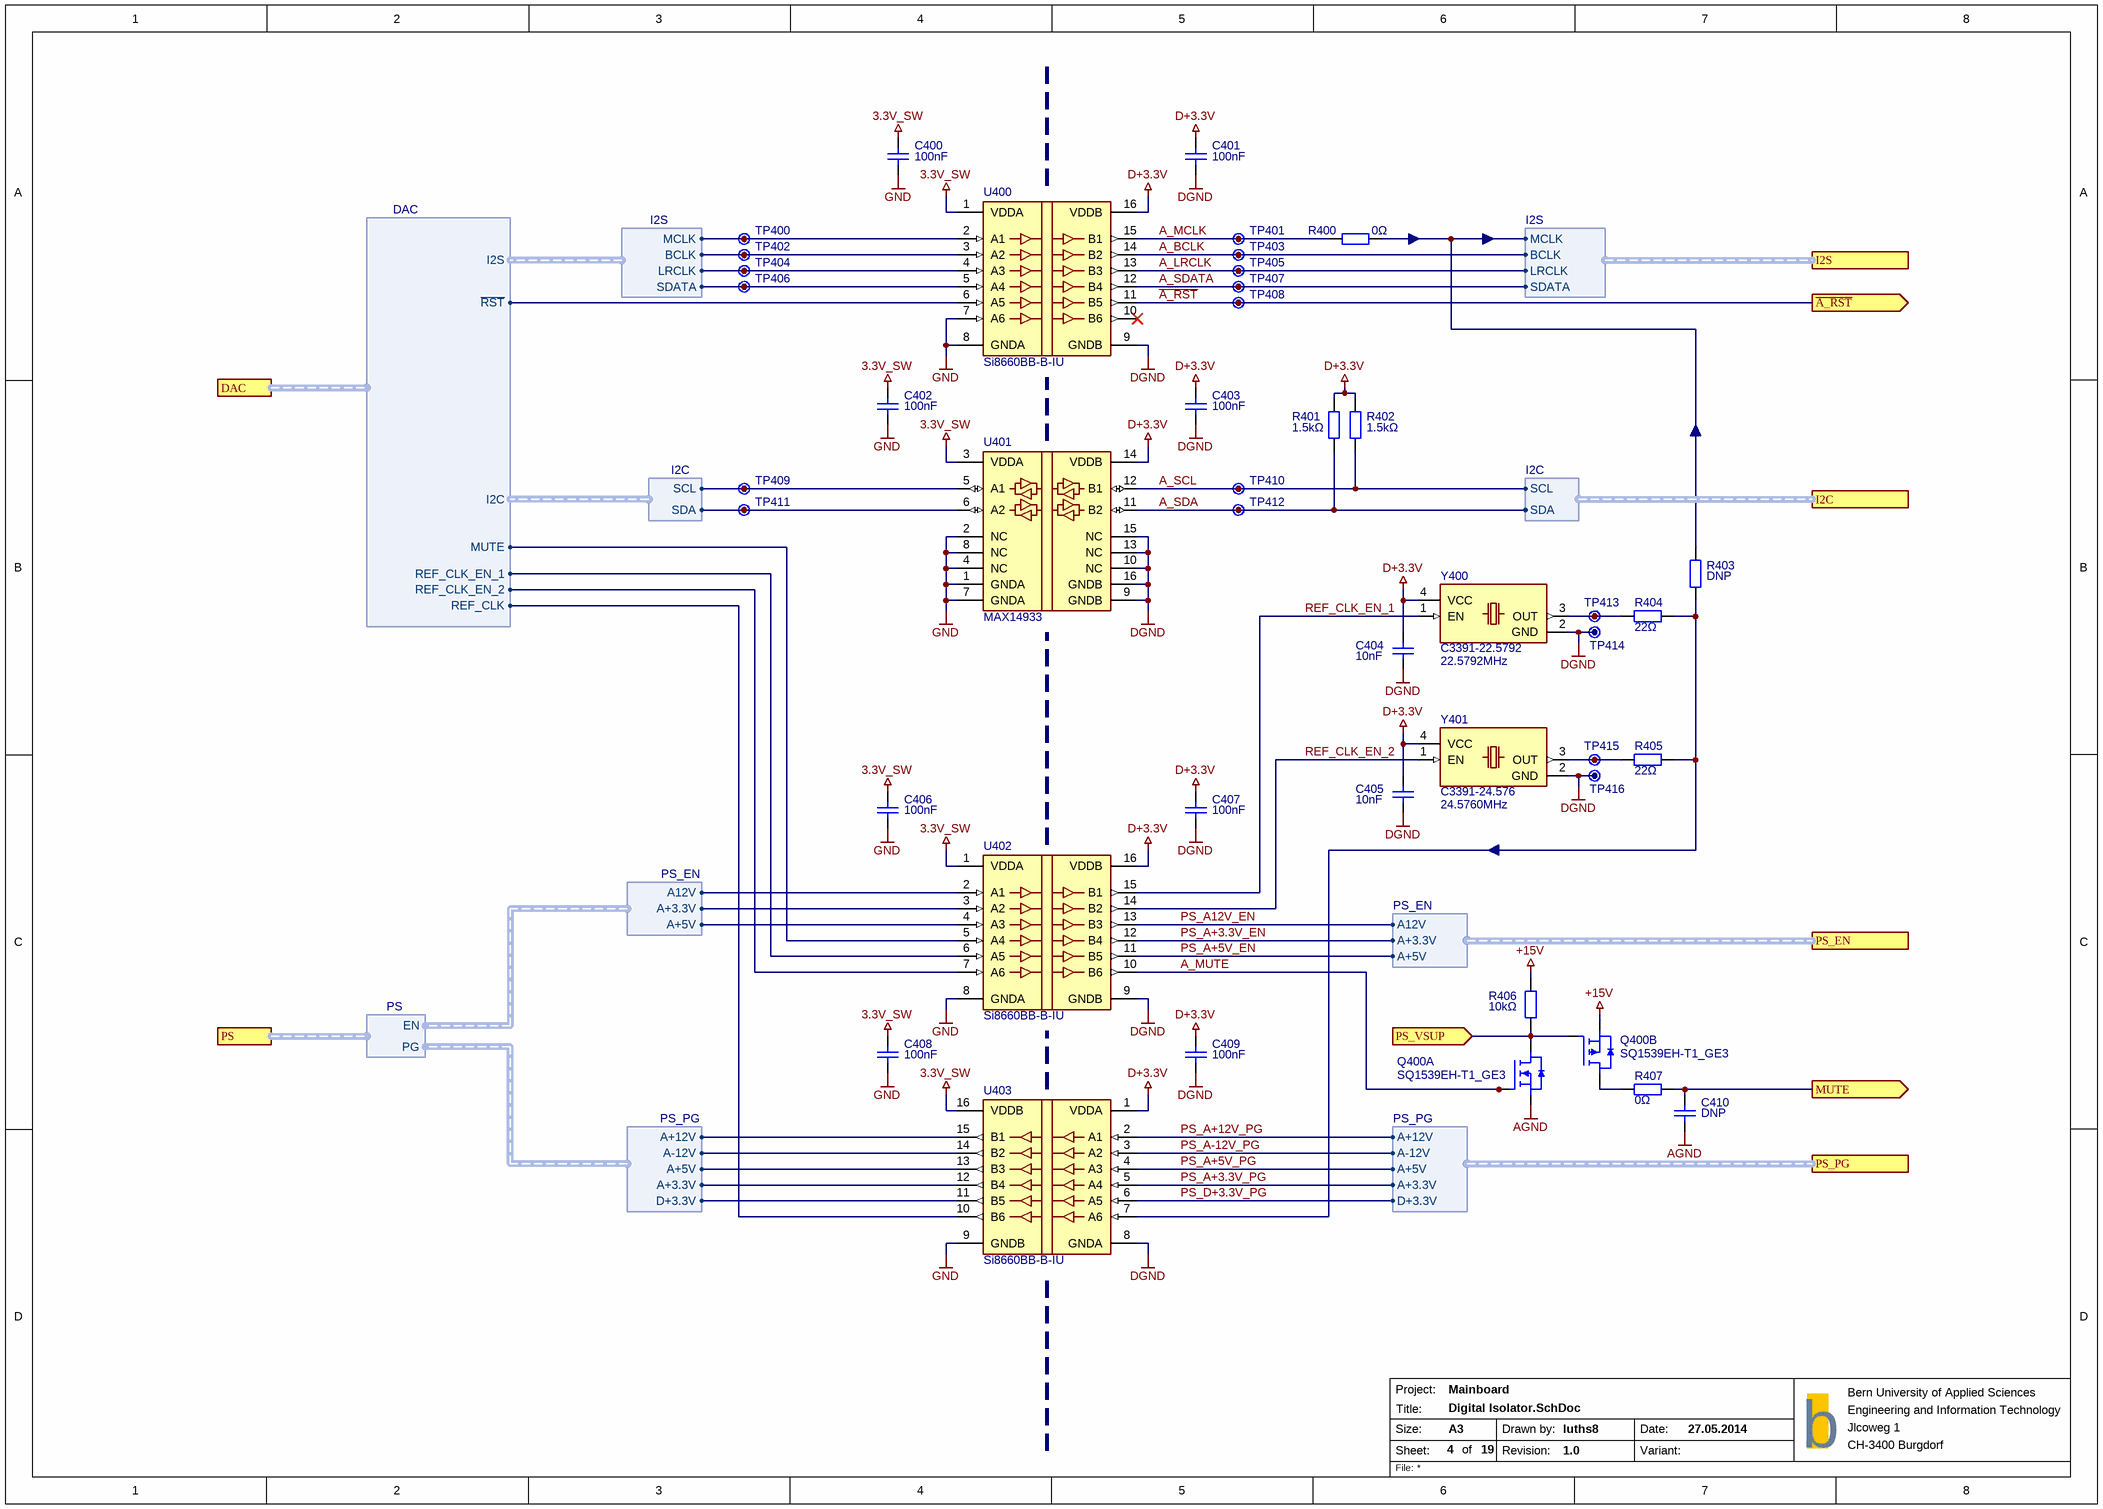
[diagram p3: Digital Isolator.SchDoc]

### Parts
C400  100nF  [SMD0603CAP]
C401  100nF  [SMD0603CAP]
C402  100nF  [SMD0603CAP]
C403  100nF  [SMD0603CAP]
C404  10nF  [SMD0603CAP]
C405  10nF  [SMD0603CAP]
C406  100nF  [SMD0603CAP]
C407  100nF  [SMD0603CAP]
C408  100nF  [SMD0603CAP]
C409  100nF  [SMD0603CAP]
C410  DNP  [SMD0603CAP]
Q400  SQ1539EH-T1_GE3  [SOT-363-6]  (parts A,B of 2)
R400  0Ω  [SMD0603RES]
R401  1.5kΩ  [SMD0603RES]
R402  1.5kΩ  [SMD0603RES]
R403  DNP  [SMD0603RES]
R404  22Ω  [SMD0603RES]
R405  22Ω  [SMD0603RES]
R406  10kΩ  [SMD0603RES]
R407  0Ω  [SMD0603RES]
TP400  Testpoint  [TP]  (value not drawn)  (no BOM)
TP401  Testpoint  [TP]  (value not drawn)  (no BOM)
TP402  Testpoint  [TP]  (value not drawn)  (no BOM)
TP403  Testpoint  [TP]  (value not drawn)  (no BOM)
TP404  Testpoint  [TP]  (value not drawn)  (no BOM)
TP405  Testpoint  [TP]  (value not drawn)  (no BOM)
TP406  Testpoint  [TP]  (value not drawn)  (no BOM)
TP407  Testpoint  [TP]  (value not drawn)  (no BOM)
TP408  Testpoint  [TP]  (value not drawn)  (no BOM)
TP409  Testpoint  [TP]  (value not drawn)  (no BOM)
TP410  Testpoint  [TP]  (value not drawn)  (no BOM)
TP411  Testpoint  [TP]  (value not drawn)  (no BOM)
TP412  Testpoint  [TP]  (value not drawn)  (no BOM)
TP413  Testpoint  [TP]  (value not drawn)  (no BOM)
TP414  Testpoint  [TP]  (value not drawn)  (no BOM)
TP415  Testpoint  [TP]  (value not drawn)  (no BOM)
TP416  Testpoint  [TP]  (value not drawn)  (no BOM)
U400  Si8660BB-B-IU  [SOIC16WIDE]
U401  MAX14933  [SOIC16WIDE]
U402  Si8660BB-B-IU  [SOIC16WIDE]
U403  Si8660BB-B-IU  [SOIC16WIDE]
Y400  C3391-22.5792  Frequency: 22.5792MHz  [OSC_CRYSTEK]
Y401  C3391-24.576  Frequency: 24.5760MHz  [OSC_CRYSTEK]

### Ports
DAC (harness DAC), I2C (harness I2C), I2S (harness I2S), MUTE (out), PS (harness PS), PS_EN (harness PS_EN), PS_PG (harness PS_PG), PS_VSUP (in), ~{A_RST} (out)

### Harnesses
I2S: MCLK, BCLK, LRCLK, SDATA
I2C: SCL, SDA
DAC: I2S, ~{RST}, I2C, MUTE, REF_CLK_EN_1, REF_CLK_EN_2, REF_CLK
PS_EN: A12V, A+3.3V, A+5V
PS_PG: A+12V, A-12V, A+3.3V, A+5V, D+3.3V
PS: EN, PG

### Nets
3.3V_SW: C400.1 C402.1 C406.1 C408.1 U400.1(VDDA) U401.3(VDDA) U402.1(VDDA) U403.16(VDDB)
+15V: Q400.4(S) R406.2
AGND: C401.2(q) C403.2(q) C404.2(q) C405.2(q) C407.2(q) C409.2(q) C410.2(q) Q400.1(S) TP414.1 TP416.1 U400.9(GNDB) U401.9(GNDB) U401.10(NC) U401.13(NC) U401.15(NC) U401.16(GNDB) U402.9(GNDB) U403.8(GNDA) Y400.2(GND) Y401.2(GND)  [also labelled DGND]
D+3.3V: C401.1 C403.1 C404.1 C405.1 C407.1 C409.1 R401.2 R402.2 U400.16(VDDB) U401.14(VDDB) U402.16(VDDB) U403.1(VDDA) Y400.4(VCC) Y401.4(VCC)
GND: C400.2(q) C402.2(q) C406.2(q) C408.2(q) U400.7(A6) U400.8(GNDA) U401.1(GNDA) U401.2(NC) U401.4(NC) U401.7(GNDA) U401.8(NC) U402.8(GNDA) U403.9(GNDB)
~{A_RST}: TP408.1 U400.11(B5) ; port ~{A_RST}
A_BCLK: TP403.1 U400.14(B2) ; port I2S.BCLK
A_LRCLK: TP405.1 U400.13(B3) ; port I2S.LRCLK
A_MCLK: R400.2 TP401.1 U400.15(B1)
A_MUTE: Q400.2(G) U402.10(B6)
A_SCL: R402.1 TP410.1 U401.12(B1) ; port I2C.SCL
A_SDA: R401.1 TP412.1 U401.11(B2) ; port I2C.SDA
A_SDATA: TP407.1 U400.12(B4) ; port I2S.SDATA
DAC_MUTE: U402.5(A4) ; port DAC.MUTE
MUTE: C410.1 R407.1 ; port MUTE
PS_A12V_EN: U402.13(B3) ; port PS_EN.A12V
PS_A+3.3V_EN: U402.12(B4) ; port PS_EN.A+3.3V
PS_A+3.3V_PG: U403.5(A4) ; port PS_PG.A+3.3V
PS_A+5V_EN: U402.11(B5) ; port PS_EN.A+5V
PS_A+5V_PG: U403.4(A3) ; port PS_PG.A+5V
PS_A+12V_PG: U403.2(A1) ; port PS_PG.A+12V
PS_A-12V_PG: U403.3(A2) ; port PS_PG.A-12V
PS_D+3.3V_PG: U403.6(A5) ; port PS_PG.D+3.3V
REF_CLK_EN_1: U402.15(B1) Y400.1(EN)
REF_CLK_EN_2: U402.14(B2) Y401.1(EN)
NetQ400_3: Q400.3(D) R407.2
NetQ400_5: Q400.5(G) Q400.6(D) R406.1 ; port PS_VSUP
NetR304_1_2: R400.1 R403.1 ; port I2S.MCLK
NetR403_2: R403.2 R404.2 R405.2 U403.7(A6)
NetR404_1: R404.1 TP413.1 Y400.3(OUT)
NetR405_1: R405.1 TP415.1 Y401.3(OUT)
NetR1200_2: TP400.1 U400.2(A1) ; harness I2S.MCLK
NetR1201_1: TP411.1 U401.6(A2) ; harness I2C.SDA
NetR1202_1: TP409.1 U401.5(A1) ; harness I2C.SCL
NetR1205_1: U403.10(B6) ; port DAC.REF_CLK
NetRA1200_5: TP406.1 U400.5(A4) ; harness I2S.SDATA
NetRA1200_6: U400.6(A5) ; port DAC.~{RST}
NetRA1200_7: TP402.1 U400.3(A2) ; harness I2S.BCLK
NetRA1200_8: TP404.1 U400.4(A3) ; harness I2S.LRCLK
NetRA1800_5: U402.2(A1) ; harness PS_EN.A12V
NetRA1800_6: U402.3(A2) ; harness PS_EN.A+3.3V
NetRA1800_7: U402.4(A3) ; harness PS_EN.A+5V
NetRA1800_8: U403.15(B1) ; harness PS_PG.A+12V
NetRA1801_5: U403.11(B5) ; harness PS_PG.D+3.3V
NetRA1801_6: U403.12(B4) ; harness PS_PG.A+3.3V
NetRA1801_7: U403.13(B3) ; harness PS_PG.A+5V
NetRA1801_8: U403.14(B2) ; harness PS_PG.A-12V
NetRA1802_6: U402.7(A6) ; port DAC.REF_CLK_EN_2
NetRA1802_7: U402.6(A5) ; port DAC.REF_CLK_EN_1

Not connected (* = marked no-connect by the designer): U400 10(B6)*

### Notes on the sheet
- Project:
- Size:
- Sheet:
- Title:
- A3
- of
- Drawn by:
- Revision:
- Date:
- Variant:
- b
- File:

### Library data of the parts
C400-C410 = Capacitor Ceramic: Ceramic Capacitor; Voltage: *; Manufacturer Part No.: *
Q400 = Transistor N/PMOS Dual: Transistor Dual, NMOS & PMOS; Manufacturer Part No.: SQ1539EH-T1_GE3
R400-R407 = Resistor: Manufacturer Part No.: *
U400 U402 U403 = Si8660BB-B-IU: Unidirectional digital isolator; Manufacturer Part No.: Si8660BB-B-IU
U401 = MAX14933: Bidirectional digital isolator; Manufacturer Part No.: MAX14933
Y400 Y401 = Oscillator Crystek: HCMOS Oscillator
  Y400: Manufacturer Part No.: C3391-22.5792
  Y401: Manufacturer Part No.: C3391-24.576
TP400-TP416 = Testpoint: Manufacturer Part No.: *

## Sheet Toradex Carrier Board.SchDoc
size A3; PageSetup: Record=PageOptions|CenterHorizontal=True|CenterVertical=True|PrintScale=0.71|XCorrection=1.00|YCorrection=1.00|PrintKind=0|BorderSize=5000000|LeftOffset=0|BottomOffset=0|Orientation=2|PaperLength=1000|PaperWidth=1000|Scale=100|PaperSource=7|PrintQuality=600|MediaType=1|DitherType=10|PaperKind=A4|PrintScaleMode=1; Date: 27.05.2014; DrawnBy: luths8; Organization: BFH; Address1: Bern University of Applied Sciences; Address2: Engineering and Information Technology; Address3: Jlcoweg 1; Address4: CH-3400 Burgdorf; DocumentNumber: 18; Revision: 1.0; SheetNumber: 5; SheetTotal: 19; CurrentDate: 27.05.2014
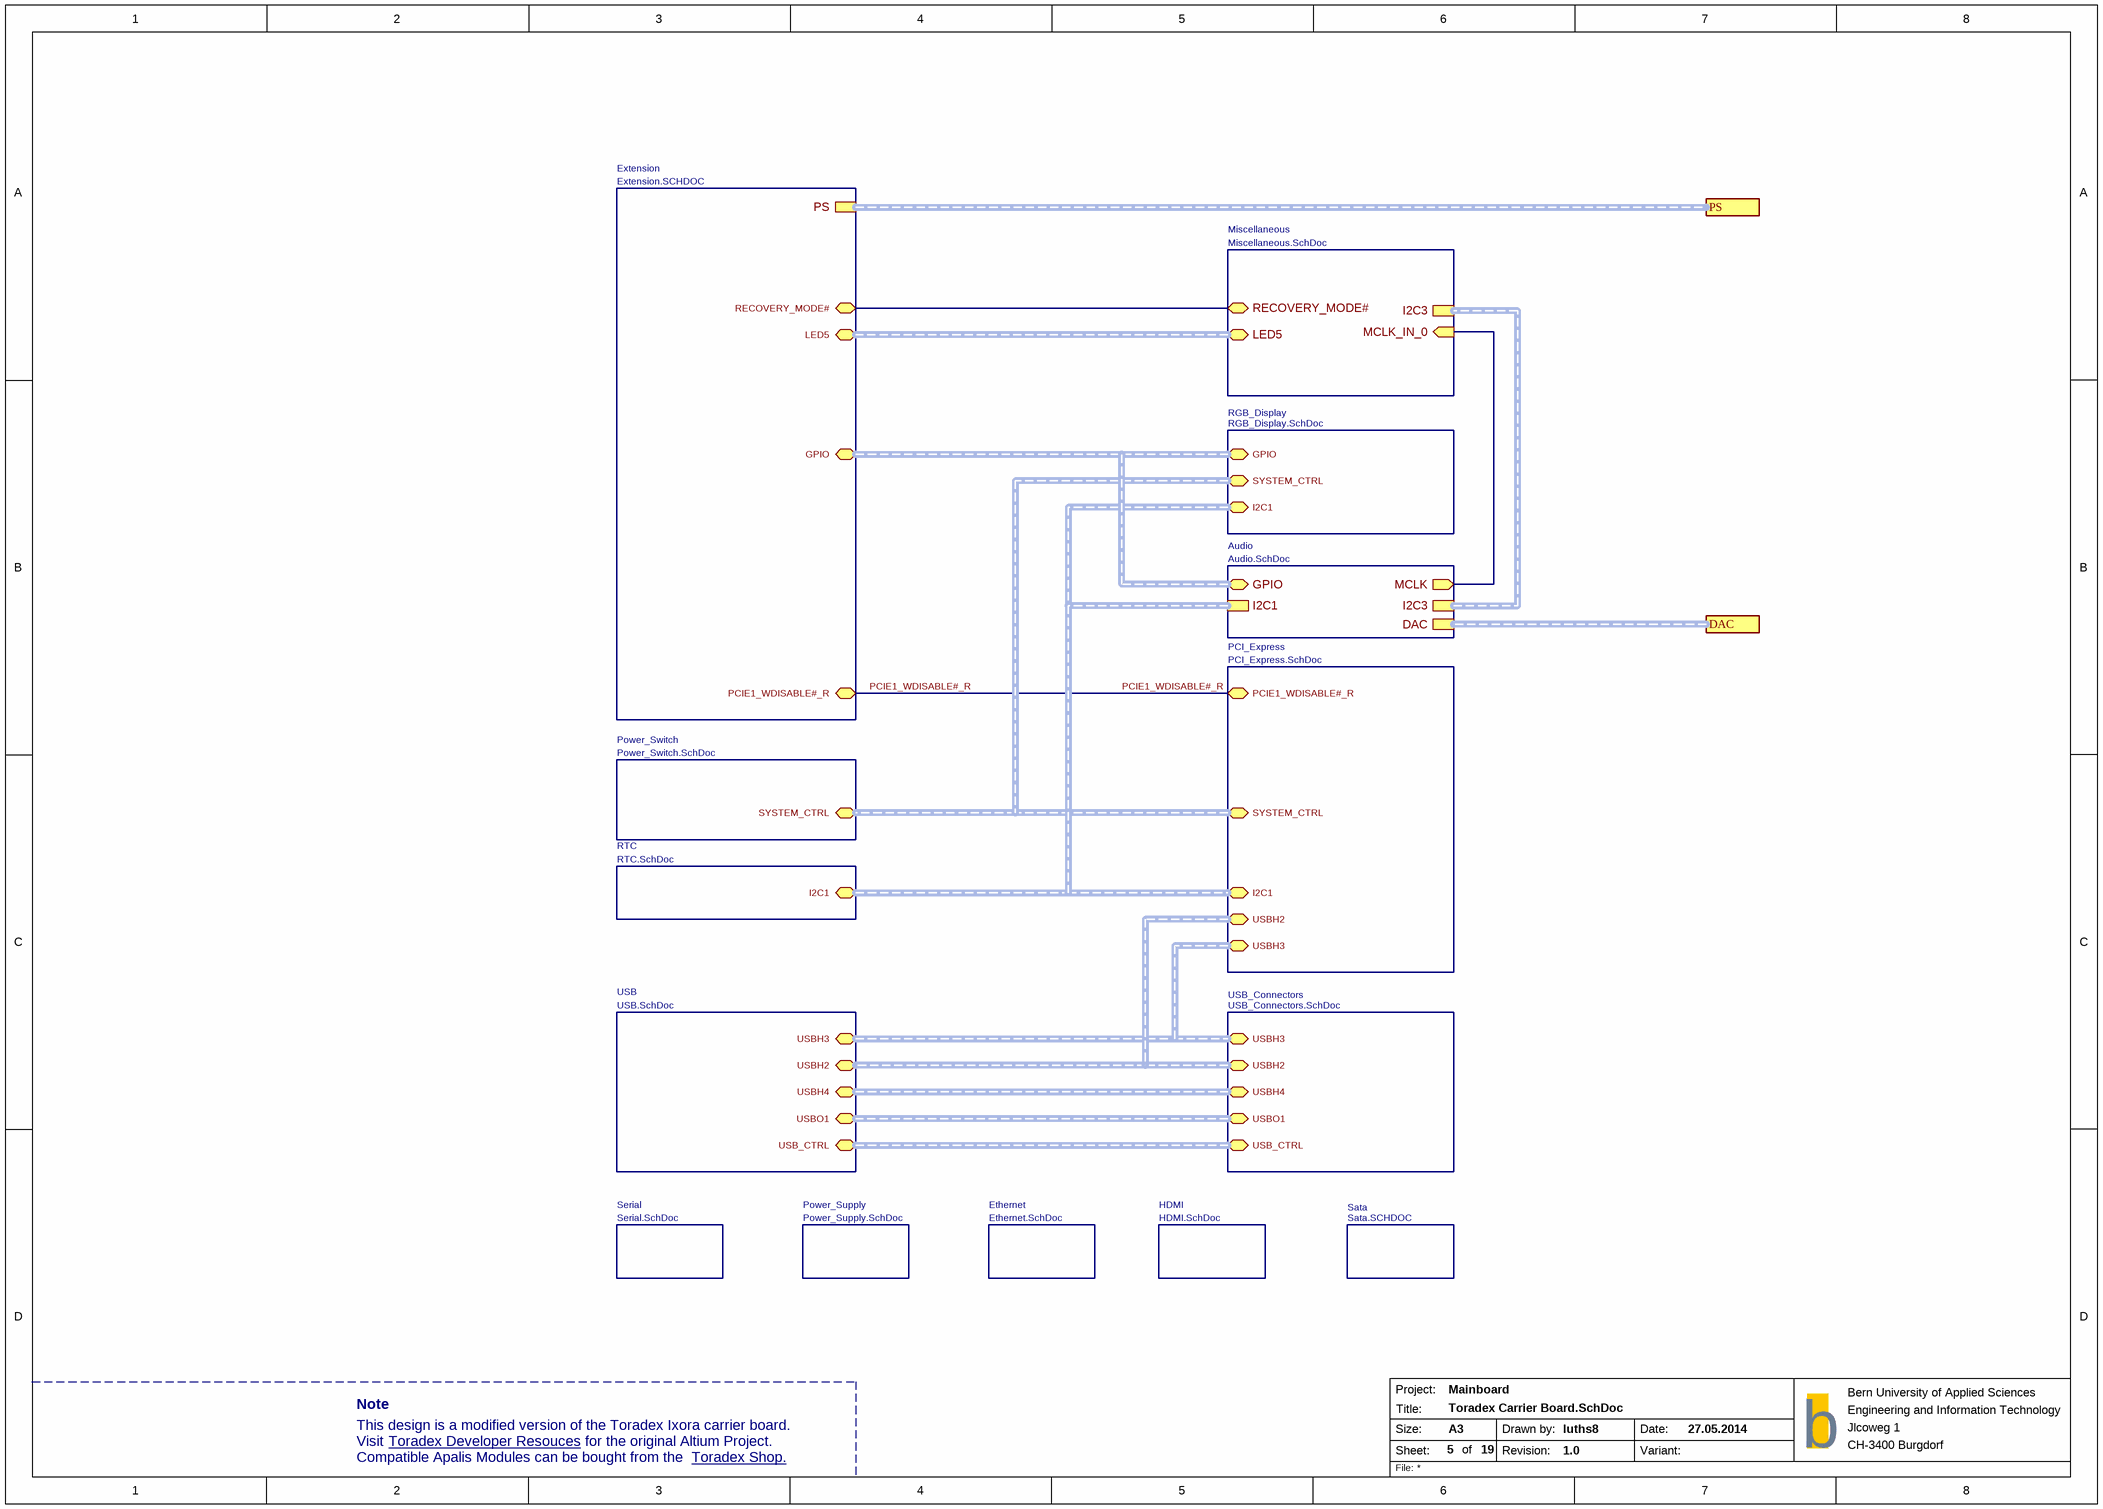
[diagram p4: Toradex Carrier Board.SchDoc]

### Sub-sheets
Audio = Audio.SchDoc: DAC (harness DAC), MCLK (out), I2C3 (harness I2C), I2C1 (harness I2C), GPIO (bidir, harness GPIO)
Ethernet = Ethernet.SchDoc: no entries
Extension = Extension.SCHDOC: GPIO (bidir, harness GPIO), RECOVERY_MODE# (bidir), PCIE1_WDISABLE#_R (bidir), LED5 (bidir, harness LED_5), PS (harness PS)
HDMI = HDMI.SchDoc: no entries
Miscellaneous = Miscellaneous.SchDoc: RECOVERY_MODE# (bidir), LED5 (bidir, harness LED_5), MCLK_IN_0 (in), I2C3 (harness I2C)
PCI_Express = PCI_Express.SchDoc: I2C1 (bidir, harness I2C), USBH2 (bidir), SYSTEM_CTRL (bidir, harness SYS_CTRL), PCIE1_WDISABLE#_R (bidir), USBH3 (bidir)
Power_Supply = Power_Supply.SchDoc: no entries
Power_Switch = Power_Switch.SchDoc: SYSTEM_CTRL (bidir, harness SYS_CTRL)
RGB_Display = RGB_Display.SchDoc: SYSTEM_CTRL (bidir, harness SYS_CTRL), GPIO (bidir, harness GPIO), I2C1 (bidir, harness I2C)
RTC = RTC.SchDoc: I2C1 (bidir, harness I2C)
Sata = Sata.SCHDOC: no entries
Serial = Serial.SchDoc: no entries
USB = USB.SchDoc: USBH2 (bidir, harness USB), USBO1 (bidir, harness USB_SS), USBH4 (bidir, harness USB_SS), USBH3 (bidir, harness USB), USB_CTRL (bidir, harness USB_CTRL)
USB_Connectors = USB_Connectors.SchDoc: USBO1 (bidir), USBH4 (bidir), USBH3 (bidir), USB_CTRL (bidir, harness USB_CTRL), USBH2 (bidir)

### Ports
DAC (harness DAC), PS (harness PS)

### Nets
MXM3_191_M: sheet Miscellaneous/MCLK_IN_0, sheet Audio/MCLK
PCIE1_WDISABLE#_R: sheet PCI_Express/PCIE1_WDISABLE#_R, sheet Extension/PCIE1_WDISABLE#_R
RECOVERY_MODE#: sheet Extension/RECOVERY_MODE#, sheet Miscellaneous/RECOVERY_MODE#

### Buses and harness runs
harness port DAC = sheet Audio/DAC
harness port PS = sheet Extension/PS
harness sheet Audio/GPIO = sheet Extension/GPIO = sheet RGB_Display/GPIO
harness sheet Audio/I2C1 = sheet PCI_Express/I2C1 = sheet RGB_Display/I2C1 = sheet RTC/I2C1
harness sheet Audio/I2C3 = sheet Miscellaneous/I2C3
harness sheet Extension/LED5 = sheet Miscellaneous/LED5
harness sheet PCI_Express/SYSTEM_CTRL = sheet Power_Switch/SYSTEM_CTRL = sheet RGB_Display/SYSTEM_CTRL
harness sheet PCI_Express/USBH2 = sheet USB/USBH2 = sheet USB_Connectors/USBH2
harness sheet PCI_Express/USBH3 = sheet USB/USBH3 = sheet USB_Connectors/USBH3
harness sheet USB/USB_CTRL = sheet USB_Connectors/USB_CTRL
harness sheet USB/USBH4 = sheet USB_Connectors/USBH4
harness sheet USB/USBO1 = sheet USB_Connectors/USBO1

### Notes on the sheet
- Note
- This design is a modified version of the Toradex Ixora carrier board.
- Visit
- Compatible Apalis Modules can be bought from the
- Toradex Developer Resouces <https://developer.toradex.com/products/ixora-carrier-board>
- for the original Altium Project.
- Toradex Shop. <https://www.toradex.com/order-now/apalis-arm-family>
- Project:
- Size:
- Sheet:
- Title:
- A3
- of
- Drawn by:
- Revision:
- Date:
- Variant:
- b
- File:

## Sheet Ethernet.SchDoc
size A3; PageSetup: Record=PageOptions|CenterHorizontal=True|CenterVertical=True|PrintScale=0.73|XCorrection=1.00|YCorrection=1.00|PrintKind=0|BorderSize=5000000|LeftOffset=0|BottomOffset=0|Orientation=2|PaperLength=1000|PaperWidth=1000|Scale=100|PaperSource=7|PrintQuality=-4|MediaType=1|DitherType=10|PaperKind=A4|PrintScaleMode=1; Date: 27.05.2014; DrawnBy: luths8; Organization: BFH; Address1: Bern University of Applied Sciences; Address2: Engineering and Information Technology; Address3: Jlcoweg 1; Address4: CH-3400 Burgdorf; DocumentNumber: 8; Revision: 1.0; SheetNumber: 11; SheetTotal: 19; CurrentDate: 27.05.2014
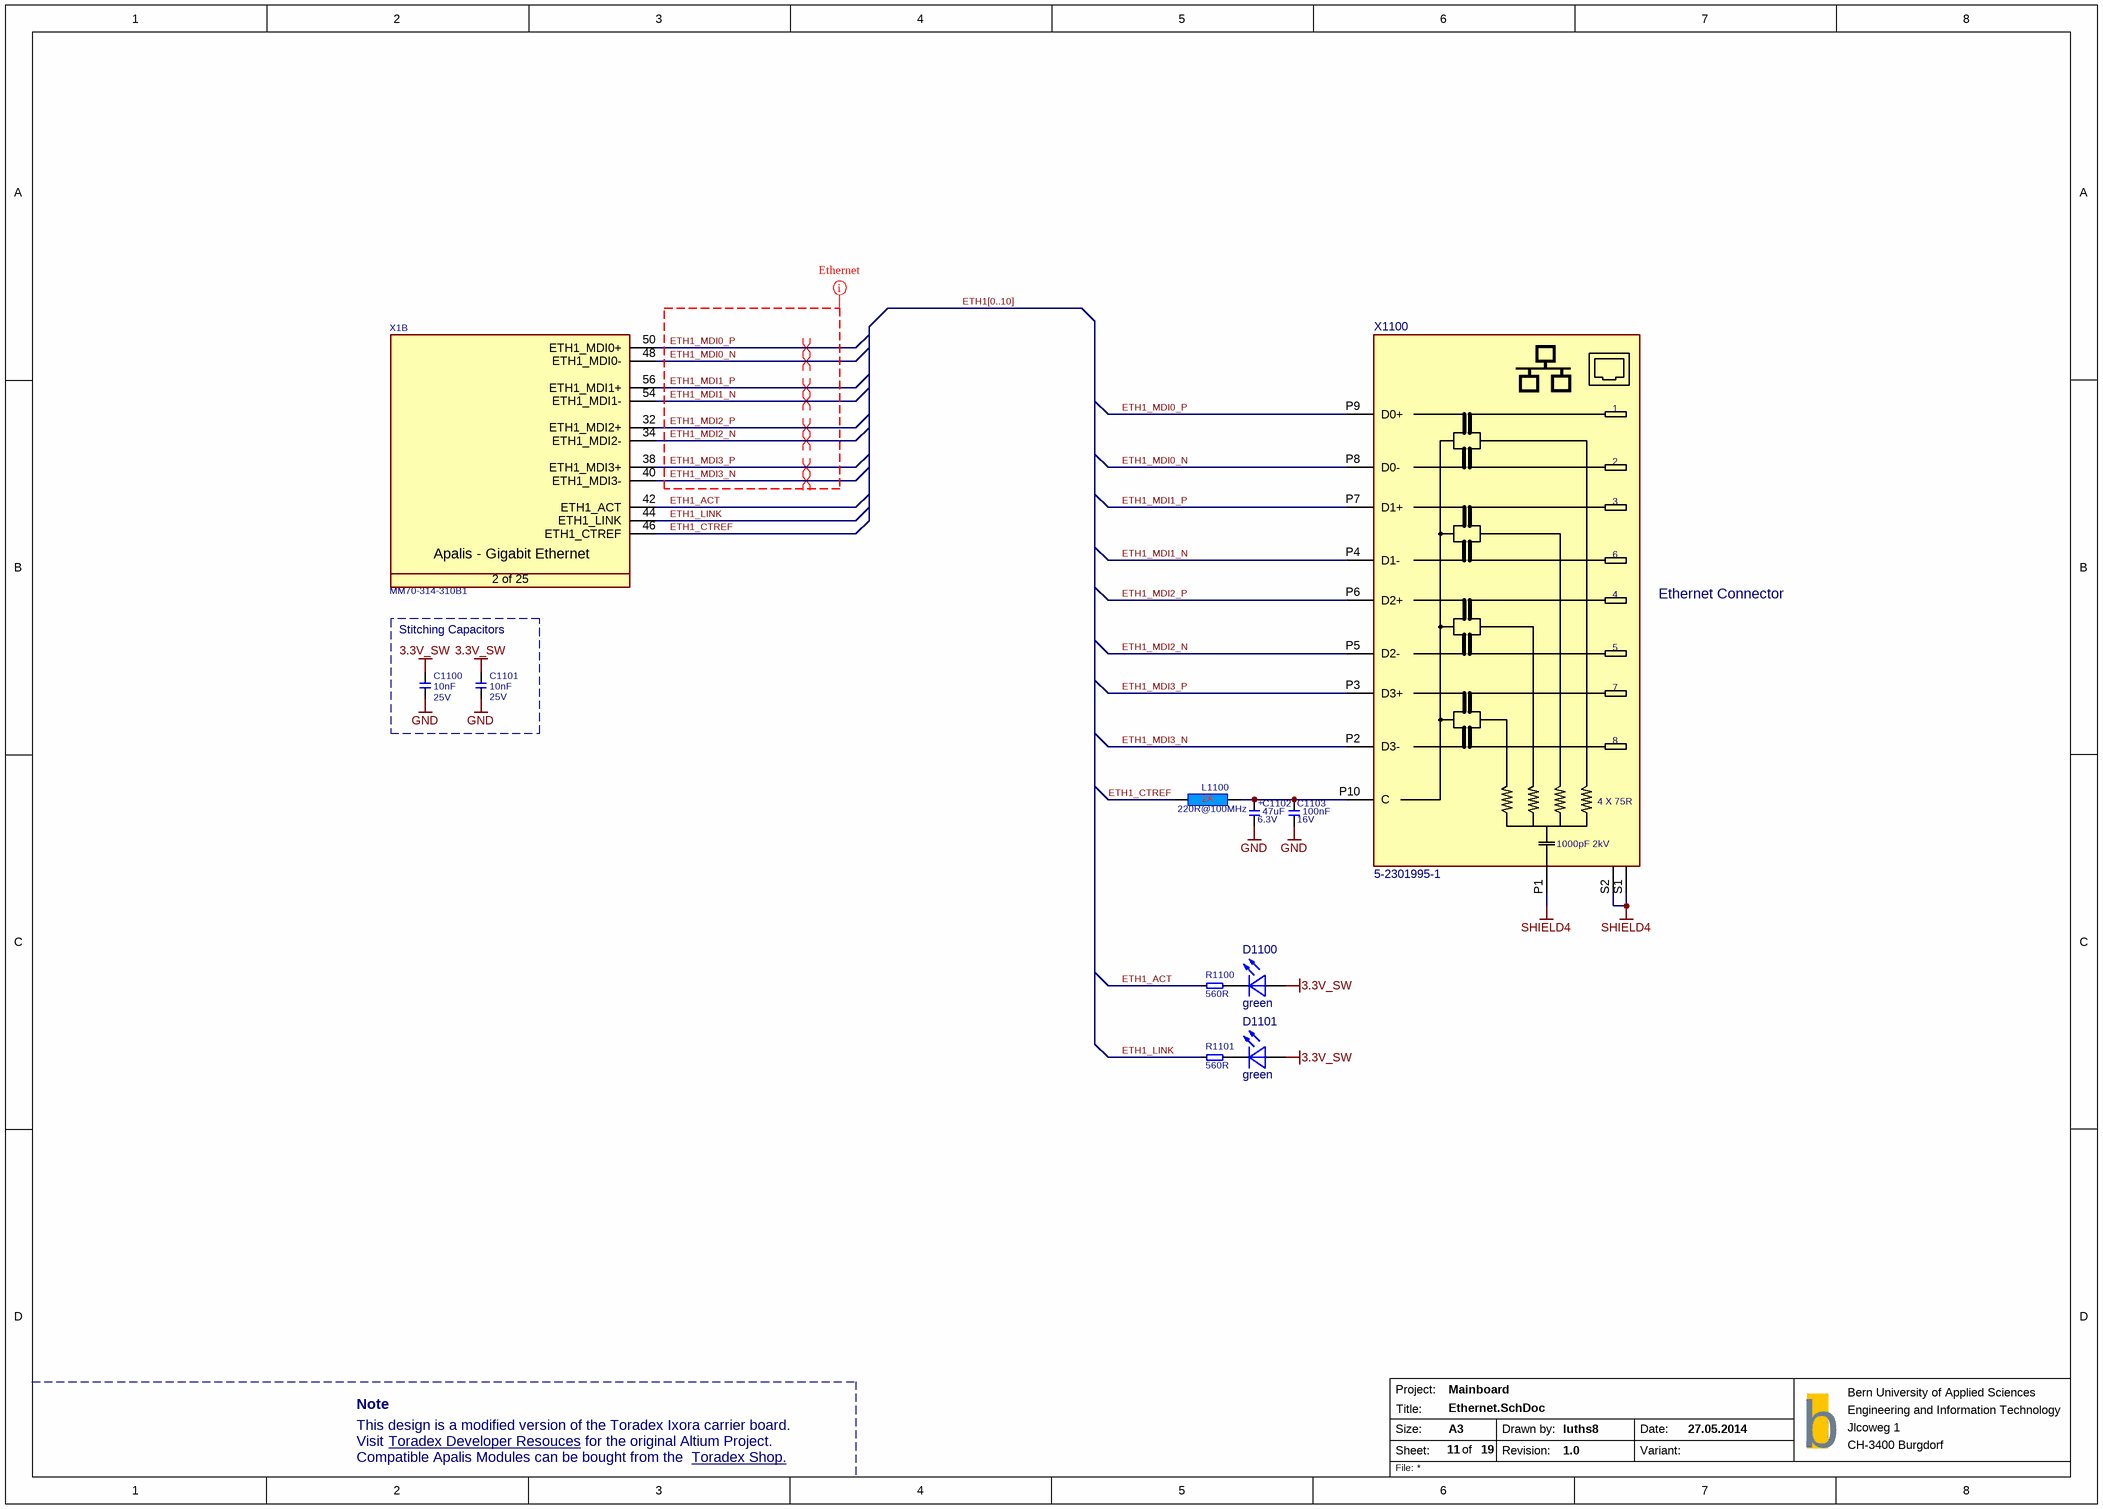
[diagram p5: Ethernet.SchDoc]

### Parts
C1100  10nF  Rating: 25V  [SMD0603CAP]
C1101  10nF  Rating: 25V  [SMD0603CAP]
C1102  Rating: 6.3V  [T_CAPMP3216X180N]  (hidden comment: 47uF)
C1103  Rating: 16V  [SMD0603CAP]  (hidden comment: 100nF)
D1100  green  [LED]
D1101  green  [LED]
L1100  220R@100MHz  [INDC1608X95N]
R1100  560R  [SMD0603RES]
R1101  560R  [SMD0603RES]
X1  Manufacturer Part No.: MM70-314-310B1  [T_JAE_MM70-314-310B1]  (hidden comment: CON-JAE-MM70-314-310B1-314-0.5mm)  (part B of 25)
X1100  5-2301995-1  [5-2301995-4]

### Blocks framed on the sheet
Stitching Capacitors: C1100 C1101

### Nets
3.3V_SW: C1100.2 C1101.2 D1100.A D1101.A
GND: C1100.1 C1101.1 C1102.2 C1103.1
SHIELD4: X1100.P1(S) X1100.S1(S) X1100.S2(S)
ETH1_ACT: R1100.1 X1.42(ETH1_ACT)
ETH1_CTREF: L1100.1 X1.46(ETH1_CTREF)
ETH1_LINK: R1101.1 X1.44(ETH1_LINK)
ETH1_MDI0_N: X1.48(ETH1_MDI0-) X1100.P8(D0-)
ETH1_MDI0_P: X1.50(ETH1_MDI0+) X1100.P9(D0+)
ETH1_MDI1_N: X1.54(ETH1_MDI1-) X1100.P4(D1-)
ETH1_MDI1_P: X1.56(ETH1_MDI1+) X1100.P7(D1+)
ETH1_MDI2_N: X1.34(ETH1_MDI2-) X1100.P5(D2-)
ETH1_MDI2_P: X1.32(ETH1_MDI2+) X1100.P6(D2+)
ETH1_MDI3_N: X1.40(ETH1_MDI3-) X1100.P2(D3-)
ETH1_MDI3_P: X1.38(ETH1_MDI3+) X1100.P3(D3+)
NetC1102_1: C1102.1 C1103.2 L1100.2 X1100.P10(C)
NetD1100_C: D1100.C R1100.2
NetD1101_C: D1101.C R1101.2

### Buses and harness runs
bus ETH1[0..10]

### Layout directives
differential pair: ETH1_MDI0_N, ETH1_MDI0_P, ETH1_MDI1_N, ETH1_MDI1_P, ETH1_MDI2_N, ETH1_MDI2_P, ETH1_MDI3_N, ETH1_MDI3_P
net class Ethernet: ETH1_MDI0_N, ETH1_MDI0_P, ETH1_MDI1_N, ETH1_MDI1_P, ETH1_MDI2_N, ETH1_MDI2_P, ETH1_MDI3_N, ETH1_MDI3_P

### Notes on the sheet
- (near X1100) Ethernet Connector
- Note
- This design is a modified version of the Toradex Ixora carrier board.
- Visit
- Compatible Apalis Modules can be bought from the
- Toradex Developer Resouces <https://developer.toradex.com/products/ixora-carrier-board>
- for the original Altium Project.
- Toradex Shop. <https://www.toradex.com/order-now/apalis-arm-family>
- Project:
- Size:
- Sheet:
- Title:
- A3
- of
- Drawn by:
- Revision:
- Date:
- Variant:
- b
- File:
- (in symbol C-TA-47uF-6.3V-20%-3216) +
- (in symbol CON-JAE-MM70-314-310B1-314-0.5mm, part B) Apalis - Gigabit Ethernet; 2 of 25
- (in symbol CON-TE-5-2301995-1) 1; 2; 3; 6; 4; 5; 7; 8; 4 X 75R; 1000pF 2kV

### Library data of the parts
C1100 C1101 = C-X7R-10nF-25V-10%-0603: Capacitor Ceramic X7R 10nF 25V 10% 0603; Tolerance: 10%; Type: X7R; Value: 10nF
C1102 = C-TA-47uF-6.3V-20%-3216: Capacitor TA 47uF 6.3V 20% 3216; Tolerance: 20%; Type: TA; Value: 47uF
C1103 = C-X7R-100nF-16V-10%-0402: Capacitor Ceramic X7R 100nF 16V 10% 0603; Tolerance: 10%; Type: X7R; Value: 100nF
D1100 D1101 = LED green: Manufacturer Part No.: LGM67KG1J224Z
L1100 = L-220R@100MHz-2A-25%-0603: 220R@100MHz 2A EMI FILTER; Tolerance: 25%; Rating: 2A; Value: 220R@100MHz
R1100 R1101 = R-560R-63mW-5%-0402: Resistor 560 ohm 63mW 5% 0603; Rating: 63mW; Tolerance: 5%; Value: 560R
X1 = CON-JAE-MM70-314-310B1-314-0.5mm: MXM3 Connector; Manufacturer Name: JAE; No. of ways: 314
X1100 = CON-TE-5-2301995-1: Vertical 10/100/1G Mag Jack; Manufacturer Part No.: 5-2301995-1

## Sheet PCI_Express.SchDoc
size A3; PageSetup: Record=PageOptions|CenterHorizontal=True|CenterVertical=True|PrintScale=0.73|XCorrection=1.00|YCorrection=1.00|PrintKind=0|BorderSize=5000000|LeftOffset=0|BottomOffset=0|Orientation=2|PaperLength=1000|PaperWidth=1000|Scale=100|PaperSource=7|PrintQuality=-4|MediaType=1|DitherType=10|PaperKind=A4|PrintScaleMode=1; Date: 27.05.2014; DrawnBy: luths8; Organization: BFH; Address1: Bern University of Applied Sciences; Address2: Engineering and Information Technology; Address3: Jlcoweg 1; Address4: CH-3400 Burgdorf; DocumentNumber: 14; Revision: 1.0; SheetNumber: 17; SheetTotal: 19; CurrentDate: 27.05.2014
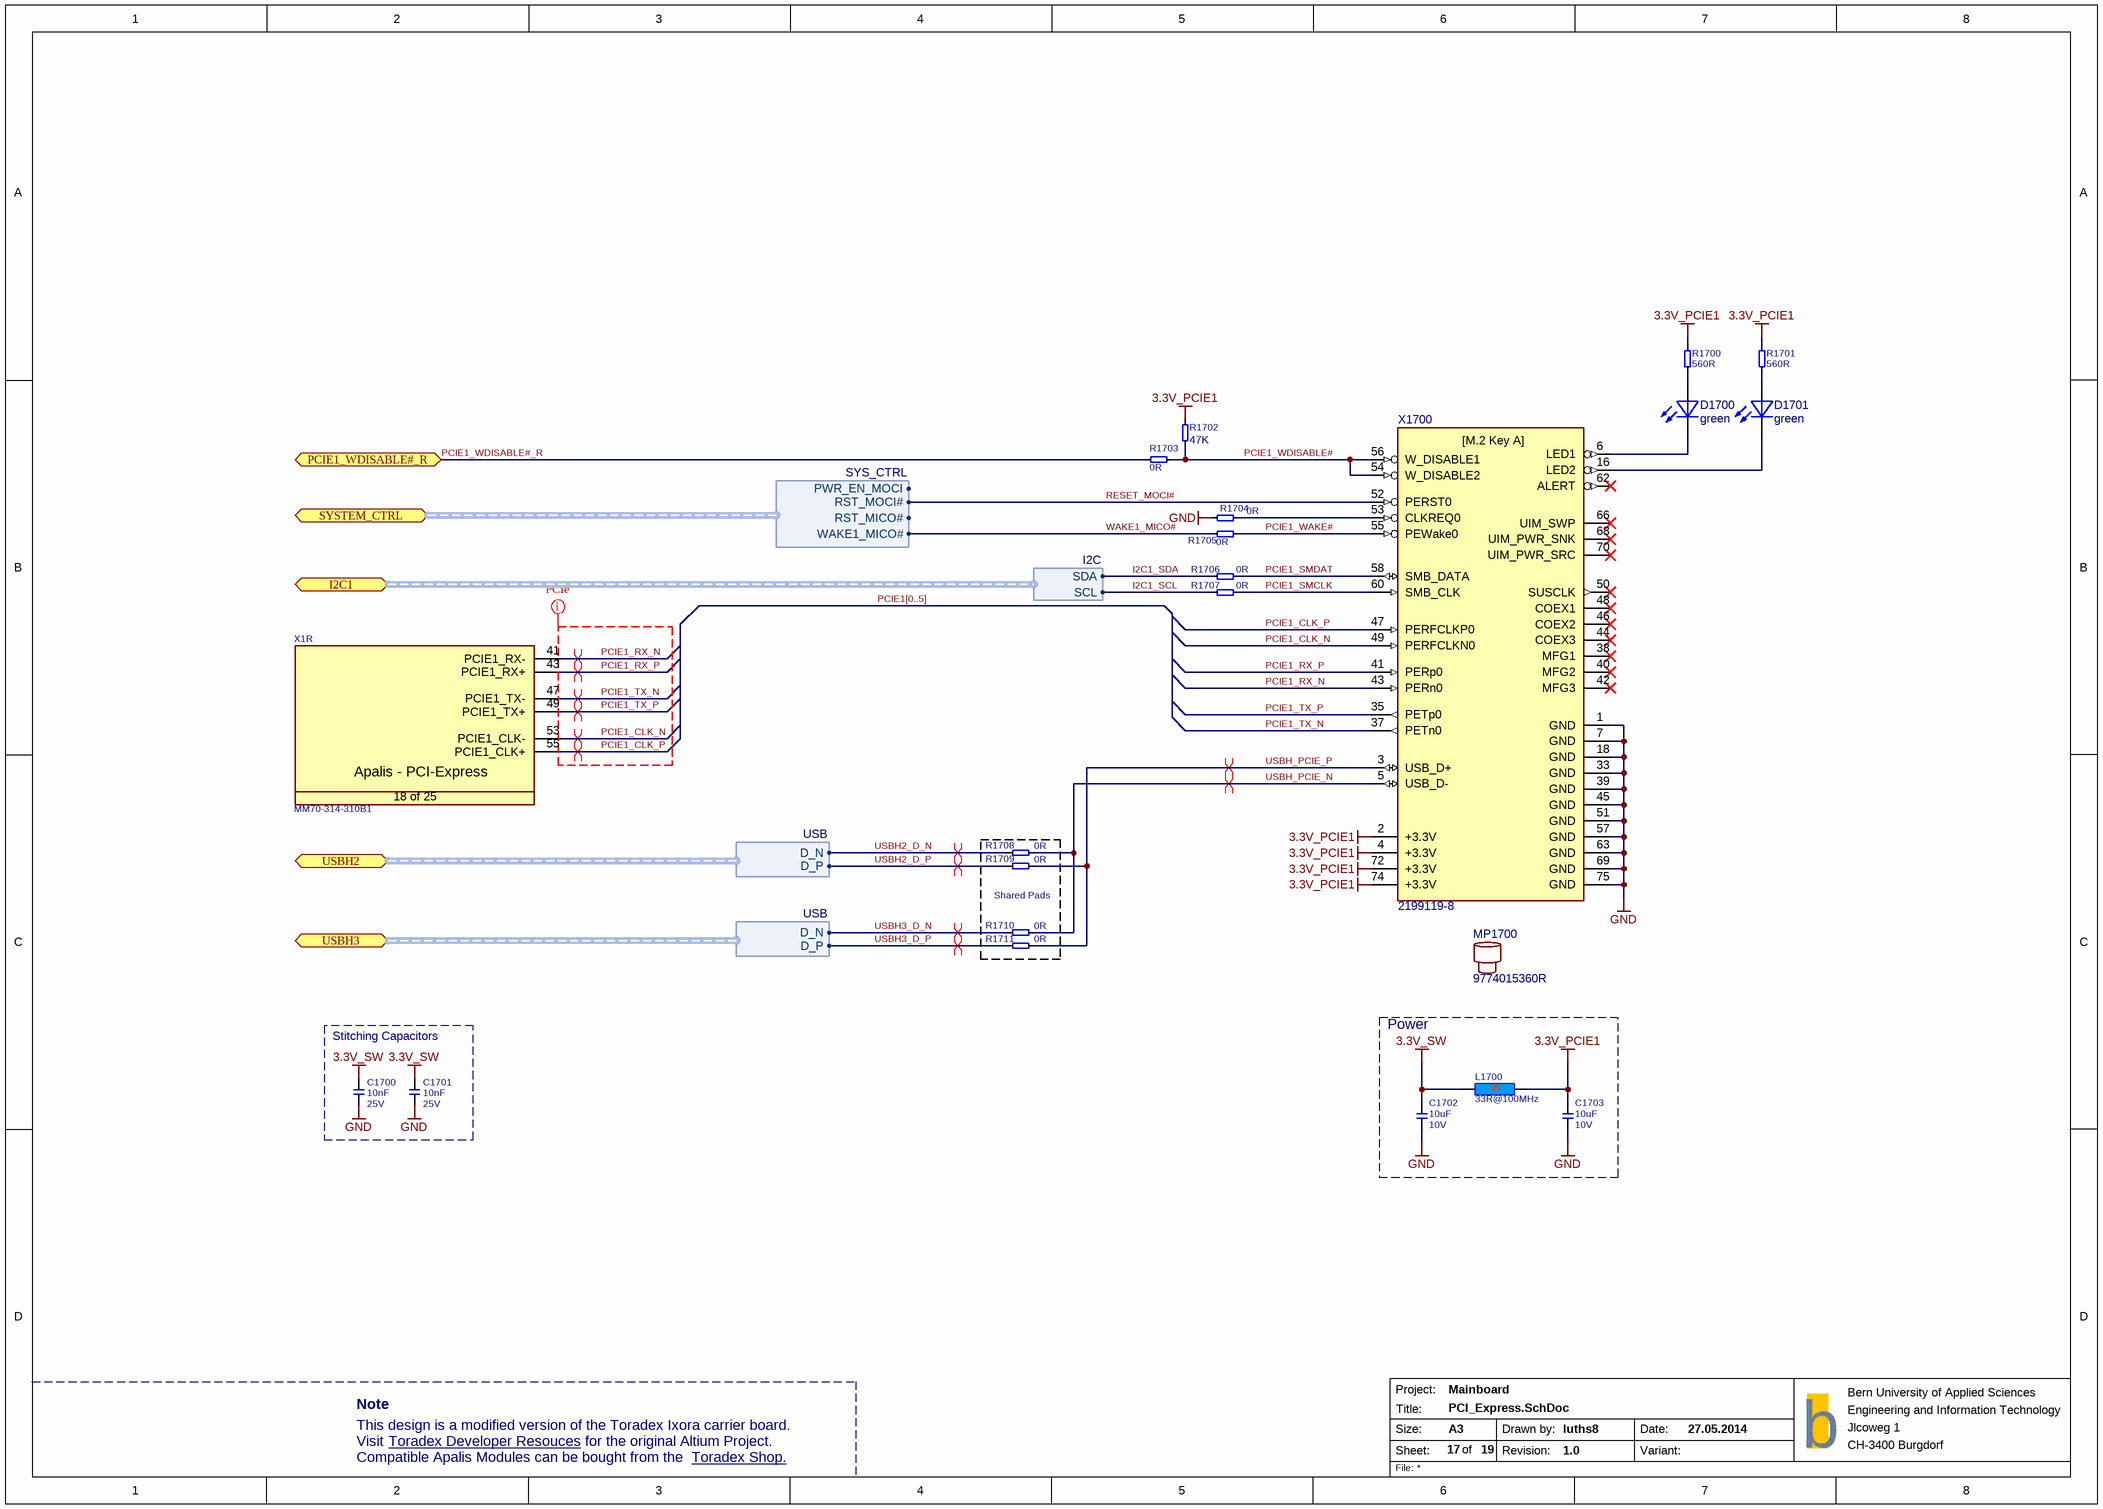
[diagram p6: PCI_Express.SchDoc]

### Parts
C1700  10nF  Rating: 25V  [SMD0603CAP]
C1701  10nF  Rating: 25V  [SMD0603CAP]
C1702  Rating: 10V  [SMD0603CAP]  (hidden comment: 10uF)
C1703  Rating: 10V  [SMD0603CAP]  (hidden comment: 10uF)
D1700  green  [LED]
D1701  green  [LED]
L1700  33R@100MHz  [INDC1608X95N]
MP1700  9774015360R
R1700  560R  [SMD0603RES]
R1701  560R  [SMD0603RES]
R1702  47K  [SMD0603RES]
R1703  0R  [SMD0603RES]
R1704  0R  [SMD0603RES]
R1705  0R  [SMD0603RES]
R1706  0R  [SMD0603RES]
R1707  0R  [SMD0603RES]
R1708  0R  [SMD0603RES]
R1709  0R  [SMD0603RES]
R1710  0R  [SMD0603RES]
R1711  0R  [SMD0603RES]
X1  Manufacturer Part No.: MM70-314-310B1  [T_JAE_MM70-314-310B1]  (hidden comment: CON-JAE-MM70-314-310B1-314-0.5mm)  (part R of 25)
X1700  2199119-8  [2199119-8-KEY-A-2230]

### Blocks framed on the sheet
Shared Pads: R1708-R1711
Stitching Capacitors: C1700 C1701
Power: C1702 C1703 L1700

### Ports
I2C1 (bidir, harness I2C, see 12, 17, 19, 5), PCIE1_WDISABLE#_R (bidir, see 19), SYSTEM_CTRL (bidir, harness SYS_CTRL, see 12, 19, 4), USBH2 (bidir, harness USB, see 6, 7), USBH3 (bidir, harness USB, see 6, 7)

### Harnesses
USB: D_N, D_P
I2C: SCL, SDA
SYS_CTRL: PWR_EN_MOCI, RST_MOCI#, RST_MICO#, WAKE1_MICO#

### Nets
3.3V_PCIE1: C1703.2 L1700.2 R1700.1 R1701.1 R1702.2 X1700.2(+3.3V) X1700.4(+3.3V) X1700.72(+3.3V) X1700.74(+3.3V)
3.3V_SW: C1700.2 C1701.2 C1702.2 L1700.1
GND: C1700.1 C1701.1 C1702.1 C1703.1 R1704.1 X1700.1(GND) X1700.7(GND) X1700.18(GND) X1700.33(GND) X1700.39(GND) X1700.45(GND) X1700.51(GND) X1700.57(GND) X1700.63(GND) X1700.69(GND) X1700.75(GND)
I2C1_SCL: R1707.1 ; port I2C1.SCL
I2C1_SDA: R1706.1 ; port I2C1.SDA
PCIE1_CLK_N: X1.53(PCIE1_CLK-) X1700.49(PERFCLKN0)
PCIE1_CLK_P: X1.55(PCIE1_CLK+) X1700.47(PERFCLKP0)
PCIE1_RX_N: X1.41(PCIE1_RX-) X1700.43(PERn0)
PCIE1_RX_P: X1.43(PCIE1_RX+) X1700.41(PERp0)
PCIE1_SMCLK: R1707.2 X1700.60(SMB_CLK)
PCIE1_SMDAT: R1706.2 X1700.58(SMB_DATA)
PCIE1_TX_N: X1.47(PCIE1_TX-) X1700.37(PETn0)
PCIE1_TX_P: X1.49(PCIE1_TX+) X1700.35(PETp0)
PCIE1_WAKE#: R1705.2 X1700.55(PEWake0)
PCIE1_WDISABLE#: R1702.1 R1703.1 X1700.54(W_DISABLE2) X1700.56(W_DISABLE1)
PCIE1_WDISABLE#_R: R1703.2 ; port PCIE1_WDISABLE#_R
RESET_MOCI#: X1700.52(PERST0) ; port SYSTEM_CTRL.RST_MOCI#
USBH2_D_N: R1708.1 ; port USBH2.D_N
USBH2_D_P: R1709.1 ; port USBH2.D_P
USBH3_D_N: R1710.1 ; port USBH3.D_N
USBH3_D_P: R1711.1 ; port USBH3.D_P
USBH_PCIE_N: R1708.2 R1710.2 X1700.5(USB_D-)
USBH_PCIE_P: R1709.2 R1711.2 X1700.3(USB_D+)
WAKE1_MICO#: R1705.1 ; port SYSTEM_CTRL.WAKE1_MICO#
NetD1700_A: D1700.A R1700.2
NetD1700_C: D1700.C X1700.6(LED1)
NetD1701_A: D1701.A R1701.2
NetD1701_C: D1701.C X1700.16(LED2)
NetR1704_2: R1704.2 X1700.53(CLKREQ0)

Not connected (* = marked no-connect by the designer): X1700 38(MFG1)* 40(MFG2)* 42(MFG3)* 44(COEX3)* 46(COEX2)* 48(COEX1)* 50(SUSCLK)* 62(ALERT)* 66(UIM_SWP)* 68(UIM_PWR_SNK)* 70(UIM_PWR_SRC)*

### Buses and harness runs
bus PCIE1[0..5]

### Layout directives
differential pair: PCIE1_CLK_N, PCIE1_CLK_P, PCIE1_RX_N, PCIE1_RX_P, PCIE1_TX_N, PCIE1_TX_P, USBH2_D_N, USBH2_D_P, USBH3_D_N, USBH3_D_P, USBH_PCIE_N, USBH_PCIE_P
net class PCIe: PCIE1_CLK_N, PCIE1_CLK_P, PCIE1_RX_N, PCIE1_RX_P, PCIE1_TX_N, PCIE1_TX_P

### Notes on the sheet
- Note
- This design is a modified version of the Toradex Ixora carrier board.
- Visit
- Compatible Apalis Modules can be bought from the
- Toradex Developer Resouces <https://developer.toradex.com/products/ixora-carrier-board>
- for the original Altium Project.
- Toradex Shop. <https://www.toradex.com/order-now/apalis-arm-family>
- Project:
- Size:
- Sheet:
- Title:
- A3
- of
- Drawn by:
- Revision:
- Date:
- Variant:
- b
- File:
- (in symbol CON-JAE-MM70-314-310B1-314-0.5mm, part R) Apalis - PCI-Express; 18 of 25
- (in symbol Connector M.2 Key A) [M.2 Key A]

### Library data of the parts
C1700 C1701 = C-X7R-10nF-25V-10%-0603: Capacitor Ceramic X7R 10nF 25V 10% 0603; Tolerance: 10%; Type: X7R; Value: 10nF
C1702 C1703 = C-X5R-10uF-10V-20%-0603: Capacitor Ceramic X5R 10uF 10V 20% 0603; Tolerance: 20%; Type: X5R; Value: 10uF
D1700 D1701 = LED green: Manufacturer Part No.: LGM67KG1J224Z
L1700 = L-33R@100MHz-3A-25%-0603: 33R@100MHz 3A EMI FILTER; Tolerance: 25%; Rating: 3A; Value: 33R@100MHz
MP1700 = Spacer M3 SMD: Manufacturer Part No.: 9774015360R
R1700 R1701 = R-560R-63mW-5%-0402: Resistor 560 ohm 63mW 5% 0603; Rating: 63mW; Tolerance: 5%; Value: 560R
R1702 = R-47KR-63mW-5%-0603: Resistor 47 Kohm 63mW 5% 0603; Value: 47KR; Rating: 63mW; Tolerance: 5%
R1703-R1705 R1708-R1711 = R-0R-63mW-1%-0603: Resistor 0 ohm 63mW 1% 0603; Rating: 63mW; Tolerance: 1%; Value: 0R
R1706 R1707 = R-0R-63mW-1%-0402: Resistor 0 ohm 63mW 1% 0603; Rating: 63mW; Tolerance: 1%; Value: 0R
X1 = CON-JAE-MM70-314-310B1-314-0.5mm: as X1 on sheet Ethernet
X1700 = Connector M.2 Key A: Manufacturer Part No.: 2199119-8

## Sheet Power_Supply.SchDoc
size A3; PageSetup: Record=PageOptions|CenterHorizontal=True|CenterVertical=True|PrintScale=0.73|XCorrection=1.00|YCorrection=1.00|PrintKind=0|BorderSize=5000000|LeftOffset=0|BottomOffset=0|Orientation=2|PaperLength=1000|PaperWidth=1000|Scale=100|PaperSource=7|PrintQuality=-4|MediaType=1|DitherType=10|PaperKind=A4|PrintScaleMode=1; Date: 27.05.2014; DrawnBy: luths8; Organization: BFH; Address1: Bern University of Applied Sciences; Address2: Engineering and Information Technology; Address3: Jlcoweg 1; Address4: CH-3400 Burgdorf; DocumentNumber: 3; Revision: 1.0; SheetNumber: 6; SheetTotal: 19; CurrentDate: 27.05.2014
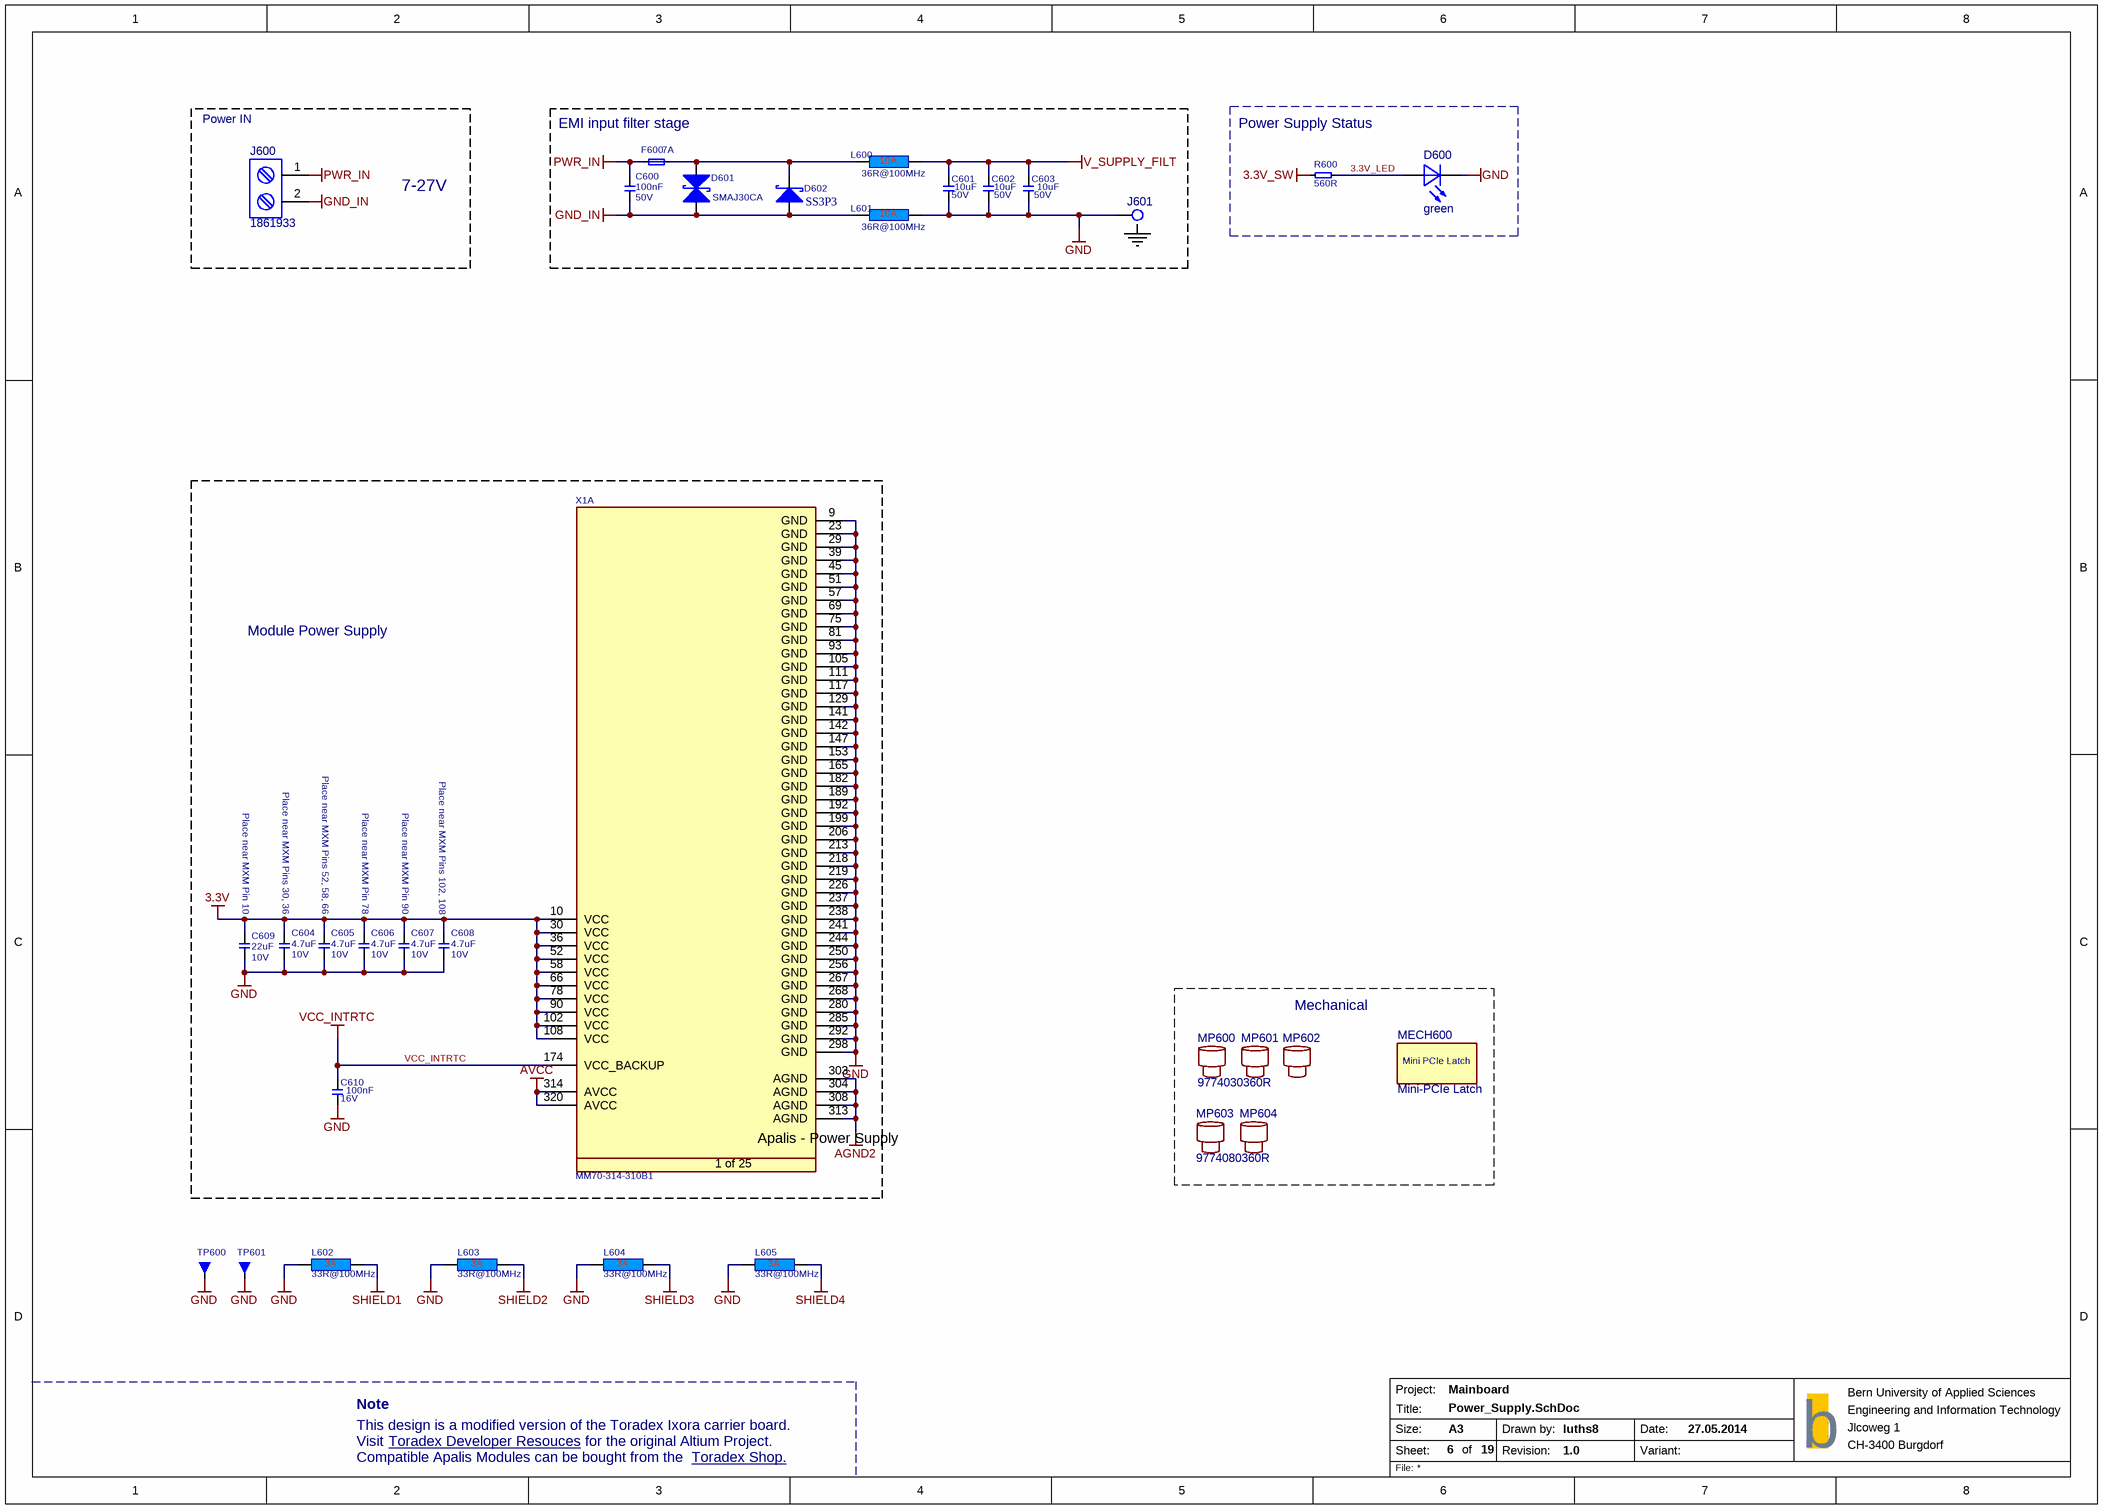
[diagram p7: Power_Supply.SchDoc]

### Parts
C600  Rating: 50V  [SMD0603CAP]  (hidden comment: 100nF)
C601  Rating: 50V  [SMD1210CAP]  (hidden comment: 10uF)
C602  Rating: 50V  [SMD1210CAP]  (hidden comment: 10uF)
C603  Rating: 50V  [SMD1210CAP]  (hidden comment: 10uF)
C604  Rating: 10V  [SMD0603CAP]  (hidden comment: 4.7uF)
C605  Rating: 10V  [SMD0603CAP]  (hidden comment: 4.7uF)
C606  Rating: 10V  [SMD0603CAP]  (hidden comment: 4.7uF)
C607  Rating: 10V  [SMD0603CAP]  (hidden comment: 4.7uF)
C608  Rating: 10V  [SMD0603CAP]  (hidden comment: 4.7uF)
C609  Rating: 10V  [SMD0805CAP]  (hidden comment: 22uF)
C610  Rating: 16V  [SMD0603CAP]  (hidden comment: 100nF)
D600  green  [LED]
D601  Manufacturer Part No.: SMAJ30CA  [T_LITTLEFUSE_SMAJ30CA]  (hidden comment: D-Littelfuse-SMAJ30CA-Schottky)
D602  SS3P3  [T_VISHAY_SS3P3]
F600  7A  [T_Littelfuse_0458]
J600  1861933  [1861933]
J601  Solder Pin  [SOLDER_PIN]  (value not drawn)  (net tie, no BOM)
L600  36R@100MHz  [T_Laird_35F0121-0SR-10]
L601  36R@100MHz  [T_Laird_35F0121-0SR-10]
L602  33R@100MHz  [INDC1608X95N]
L603  33R@100MHz  [INDC1608X95N]
L604  33R@100MHz  [INDC1608X95N]
L605  33R@100MHz  [INDC1608X95N]
MECH600  Mini-PCIe Latch  [T_Molex_48099-5701]
MP600  9774030360R
MP601  9774030360R  (value not drawn)
MP602  9774030360R  (value not drawn)
MP603  9774080360R
MP604  9774080360R  (value not drawn)
R600  560R  [SMD0603RES]
TP600  5011  [T_TP-THT - EYE]  (value not drawn)
TP601  5011  [T_TP-THT - EYE]  (value not drawn)
X1  Manufacturer Part No.: MM70-314-310B1  [T_JAE_MM70-314-310B1]  (hidden comment: CON-JAE-MM70-314-310B1-314-0.5mm)  (part A of 25)

### Blocks framed on the sheet
7-27V: J600
EMI input filter stage: C600-C603 D601 D602 F600 J601 L600 L601
Power Supply Status: D600 R600
Module Power Supply: C604-C610 X1
Mechanical: MECH600 MP600-MP604

### Nets
3.3V: C604.1 C605.1 C606.1 C607.1 C608.1 C609.1 X1.10(VCC) X1.30(VCC) X1.36(VCC) X1.52(VCC) X1.58(VCC) X1.66(VCC) X1.78(VCC) X1.90(VCC) X1.102(VCC) X1.108(VCC)
3.3V_SW: R600.1
AGND2: X1.303(AGND) X1.304(AGND) X1.308(AGND) X1.313(AGND)
AVCC: X1.314(AVCC) X1.320(AVCC)
GND: C601.1 C602.1 C603.1 C604.2 C605.2 C606.2 C607.2 C608.2 C609.2 C610.1 D600.C J601.1 L601.2 L602.1 L603.1 L604.1 L605.1 TP600.1 TP601.1 X1.9(GND) X1.23(GND) X1.29(GND) X1.39(GND) X1.45(GND) X1.51(GND) X1.57(GND) X1.69(GND) X1.75(GND) X1.81(GND) X1.93(GND) X1.105(GND) X1.111(GND) X1.117(GND) X1.129(GND) X1.141(GND) X1.142(GND) X1.147(GND) X1.153(GND) X1.165(GND) X1.182(GND) X1.189(GND) X1.192(GND) X1.199(GND) X1.206(GND) X1.213(GND) X1.218(GND) X1.219(GND) X1.226(GND) X1.237(GND) X1.238(GND) X1.241(GND) X1.244(GND) X1.250(GND) X1.256(GND) X1.267(GND) X1.268(GND) X1.280(GND) X1.285(GND) X1.292(GND) X1.298(GND)
GND_IN: C600.1 D601.2(Anode) D602.2 J600.2 L601.1
PWR_IN: C600.2 F600.1 J600.1
SHIELD1: L602.2
SHIELD2: L603.2
SHIELD3: L604.2
SHIELD4: L605.2
V_SUPPLY_FILT: C601.2 C602.2 C603.2 L600.2
VCC_INTRTC: C610.2 X1.174(VCC_BACKUP)
3.3V_LED: D600.A R600.2
NetD601_1: D601.1(Cathode) D602.1 F600.2 L600.1

### Notes on the sheet
- Power IN
- (near C604) Place near MXM Pins 30, 36
- (near C605) Place near MXM Pins 52, 58, 66
- Place near MXM Pins 102, 108
- Place near MXM Pin 10
- Place near MXM Pin 78
- Place near MXM Pin 90
- Note
- This design is a modified version of the Toradex Ixora carrier board.
- Visit
- Compatible Apalis Modules can be bought from the
- Toradex Developer Resouces <https://developer.toradex.com/products/ixora-carrier-board>
- for the original Altium Project.
- Toradex Shop. <https://www.toradex.com/order-now/apalis-arm-family>
- Project:
- Size:
- Sheet:
- Title:
- A3
- of
- Drawn by:
- Revision:
- Date:
- Variant:
- b
- File:
- (in symbol CON-JAE-MM70-314-310B1-314-0.5mm, part A) Apalis - Power Supply; 1 of 25
- (in symbol MECH-Molex-48099-5701) Mini PCIe Latch

### Library data of the parts
C600 = C-X7R-100nF-50V-20%-0603: Capacitor Ceramic X7R 100nF 50V 20% 0603; Tolerance: 20%; Type: X7R; Value: 100nF
C601-C603 = C-X5R-10uF-50V-20%-1210: Capacitor Ceramic X5R 10uF 50V 20% 1210; Tolerance: 20%; Type: X5R; Value: 10uF
C604-C608 = C-X5R-4.7uF-10V-10%-0603: Capacitor Ceramic X5R 4.7uF 10V 10% 0603; Tolerance: 10%; Type: X5R; Value: 4.7uF
C609 = C-X5R-22uF-10V-20%-0805: Capacitor Ceramic X5R 22uF 10V 20% 0805; Tolerance: 20%; Type: X5R; Value: 22uF
C610 = C-X7R-100nF-16V-10%-0402: Capacitor Ceramic X7R 100nF 16V 10% 0603; Tolerance: 10%; Type: X7R; Value: 100nF
D600 = LED green: Manufacturer Part No.: LGM67KG1J224Z
D601 = D-Littelfuse-SMAJ30CA-Schottky: Bidirectional ESD protection; Manufacturer Name: Littelfuse
D602 = D-Vishay-SS3P3-E3/84A-Schottky: SS3P3-E3/84A Schottky Diode; Manufacturer Name: Vishay; Manufacturer Part No.: SS3P3-E3/84A
F600 = F-Littelfuse-0458007: Fuse 7A Fast; Manufacturer Part No.: 0458007; Manufacturer Name: Littelfuse; Value: 7A
J600 = 1861933: Screw Terminal, 2 Position, 5mm Spacing; System: Connector
L600 L601 = L-Laird-35F0121-0SR-10-10A-25%: Power Supply FB 10A; Tolerance: 25%; Rating: 10A; Value: 36R@100MHz
L602-L605 = L-33R@100MHz-3A-25%-0603: 33R@100MHz 3A EMI FILTER; Tolerance: 25%; Rating: 3A; Value: 33R@100MHz
MECH600 = MECH-Molex-48099-5701: Manufacturer Name: Molex; Manufacturer Part No.: 48099-5701
MP600-MP604 = Spacer M3 SMD
  MP600-MP602: Manufacturer Part No.: 9774030360R
  MP603 MP604: Manufacturer Part No.: 9774080360R
R600 = R-560R-63mW-5%-0402: Resistor 560 ohm 63mW 5% 0603; Rating: 63mW; Tolerance: 5%; Value: 560R
TP600 TP601 = TP-Keystone-5011: Testpin Eye TH; Manufacturere Name: Keystone; Manufacturer Part No.: 5011
X1 = CON-JAE-MM70-314-310B1-314-0.5mm: as X1 on sheet Ethernet